# EAGLE board 20150319_QSE_TO_FMC_DP_R5.6_FOR_REVIEW (EAGLE 7.2.0), part 1 of 6
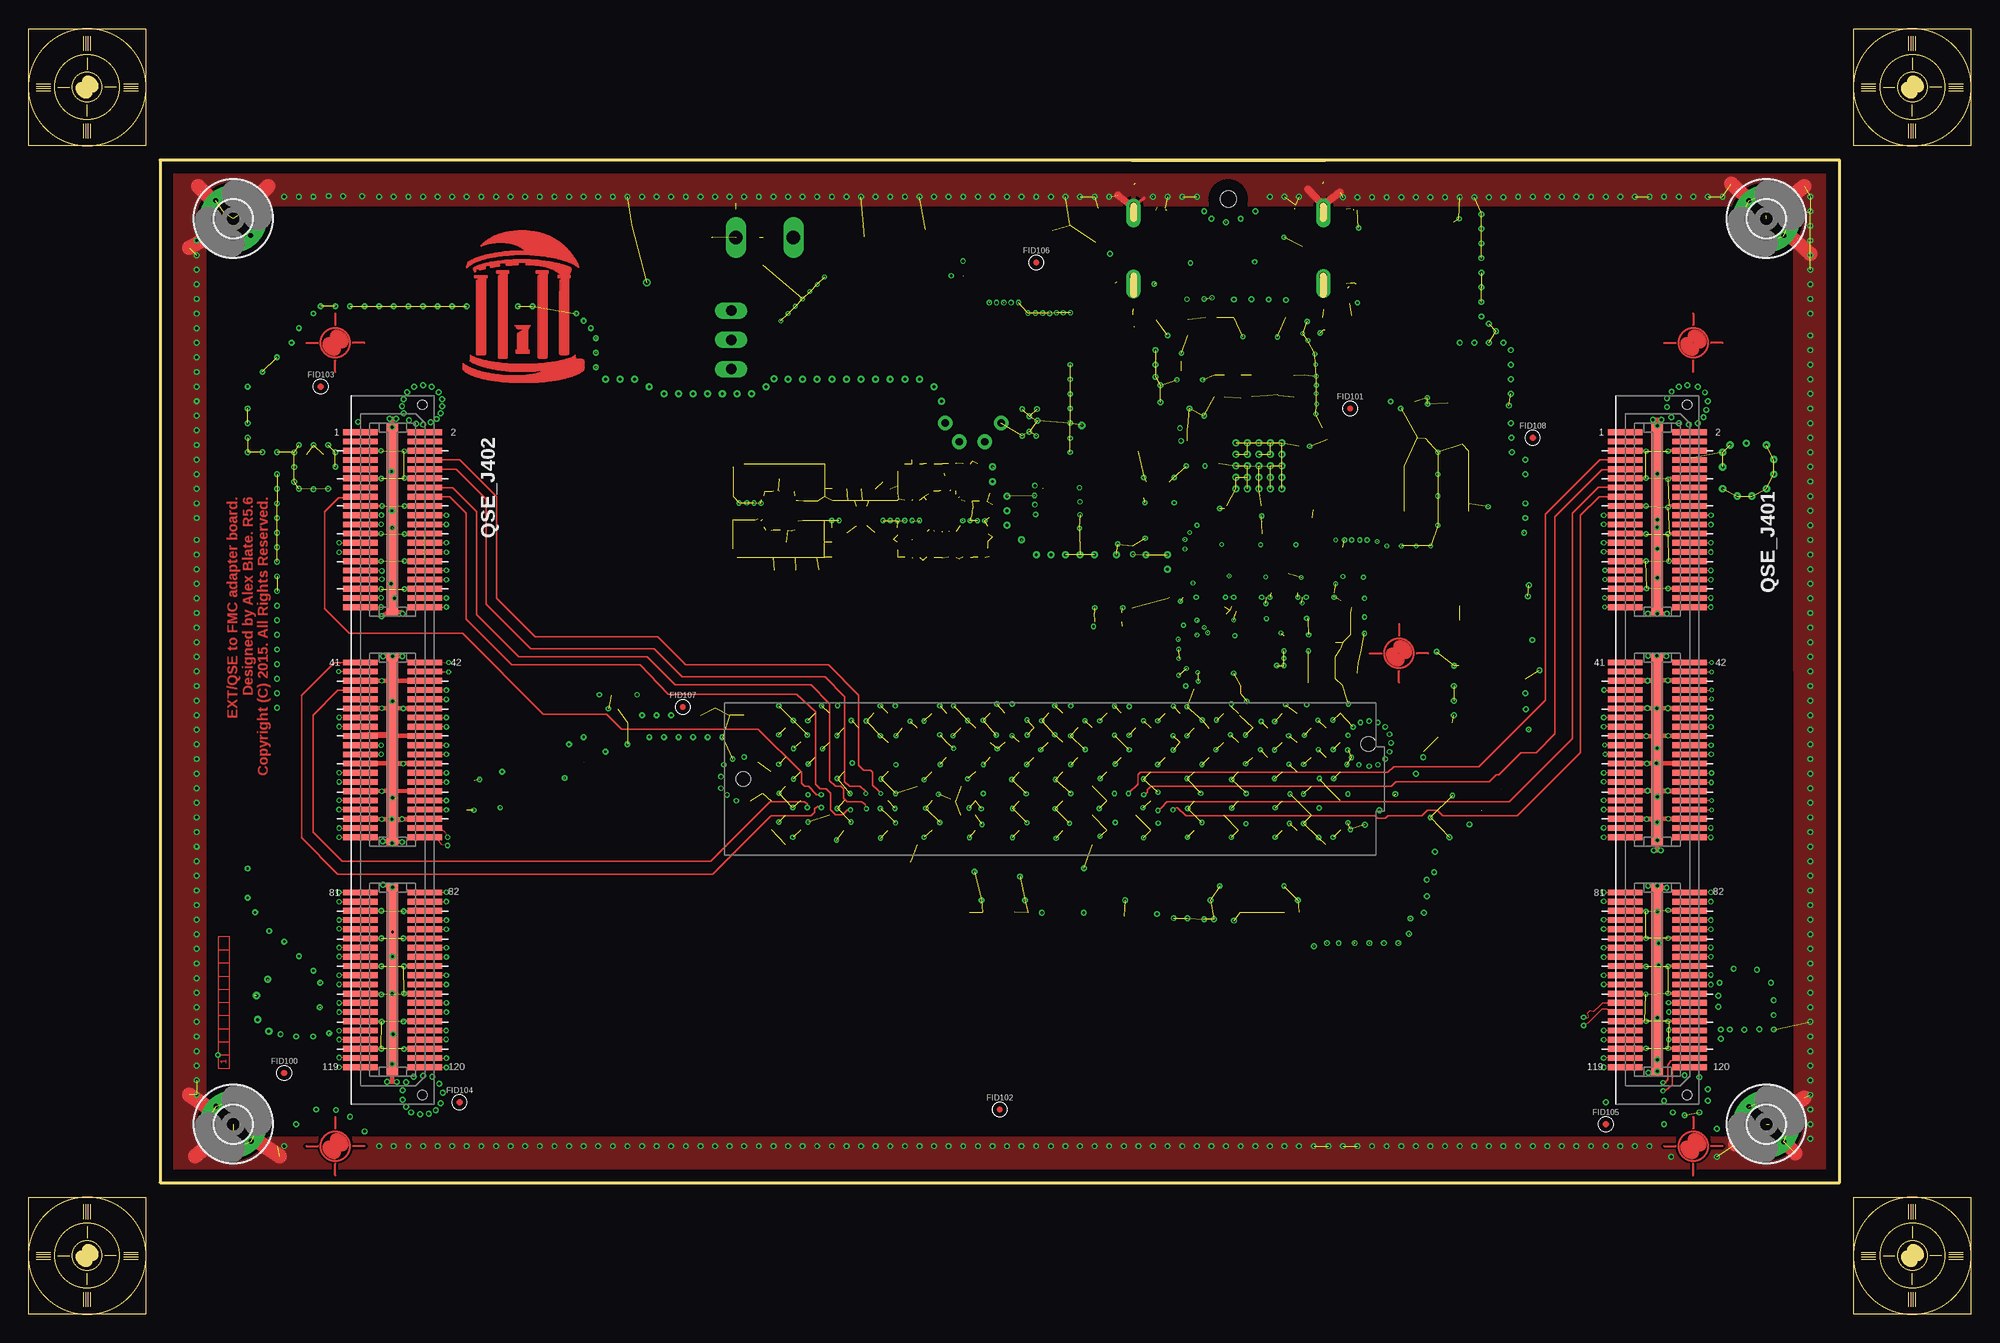
[diagram p8: board, top side]
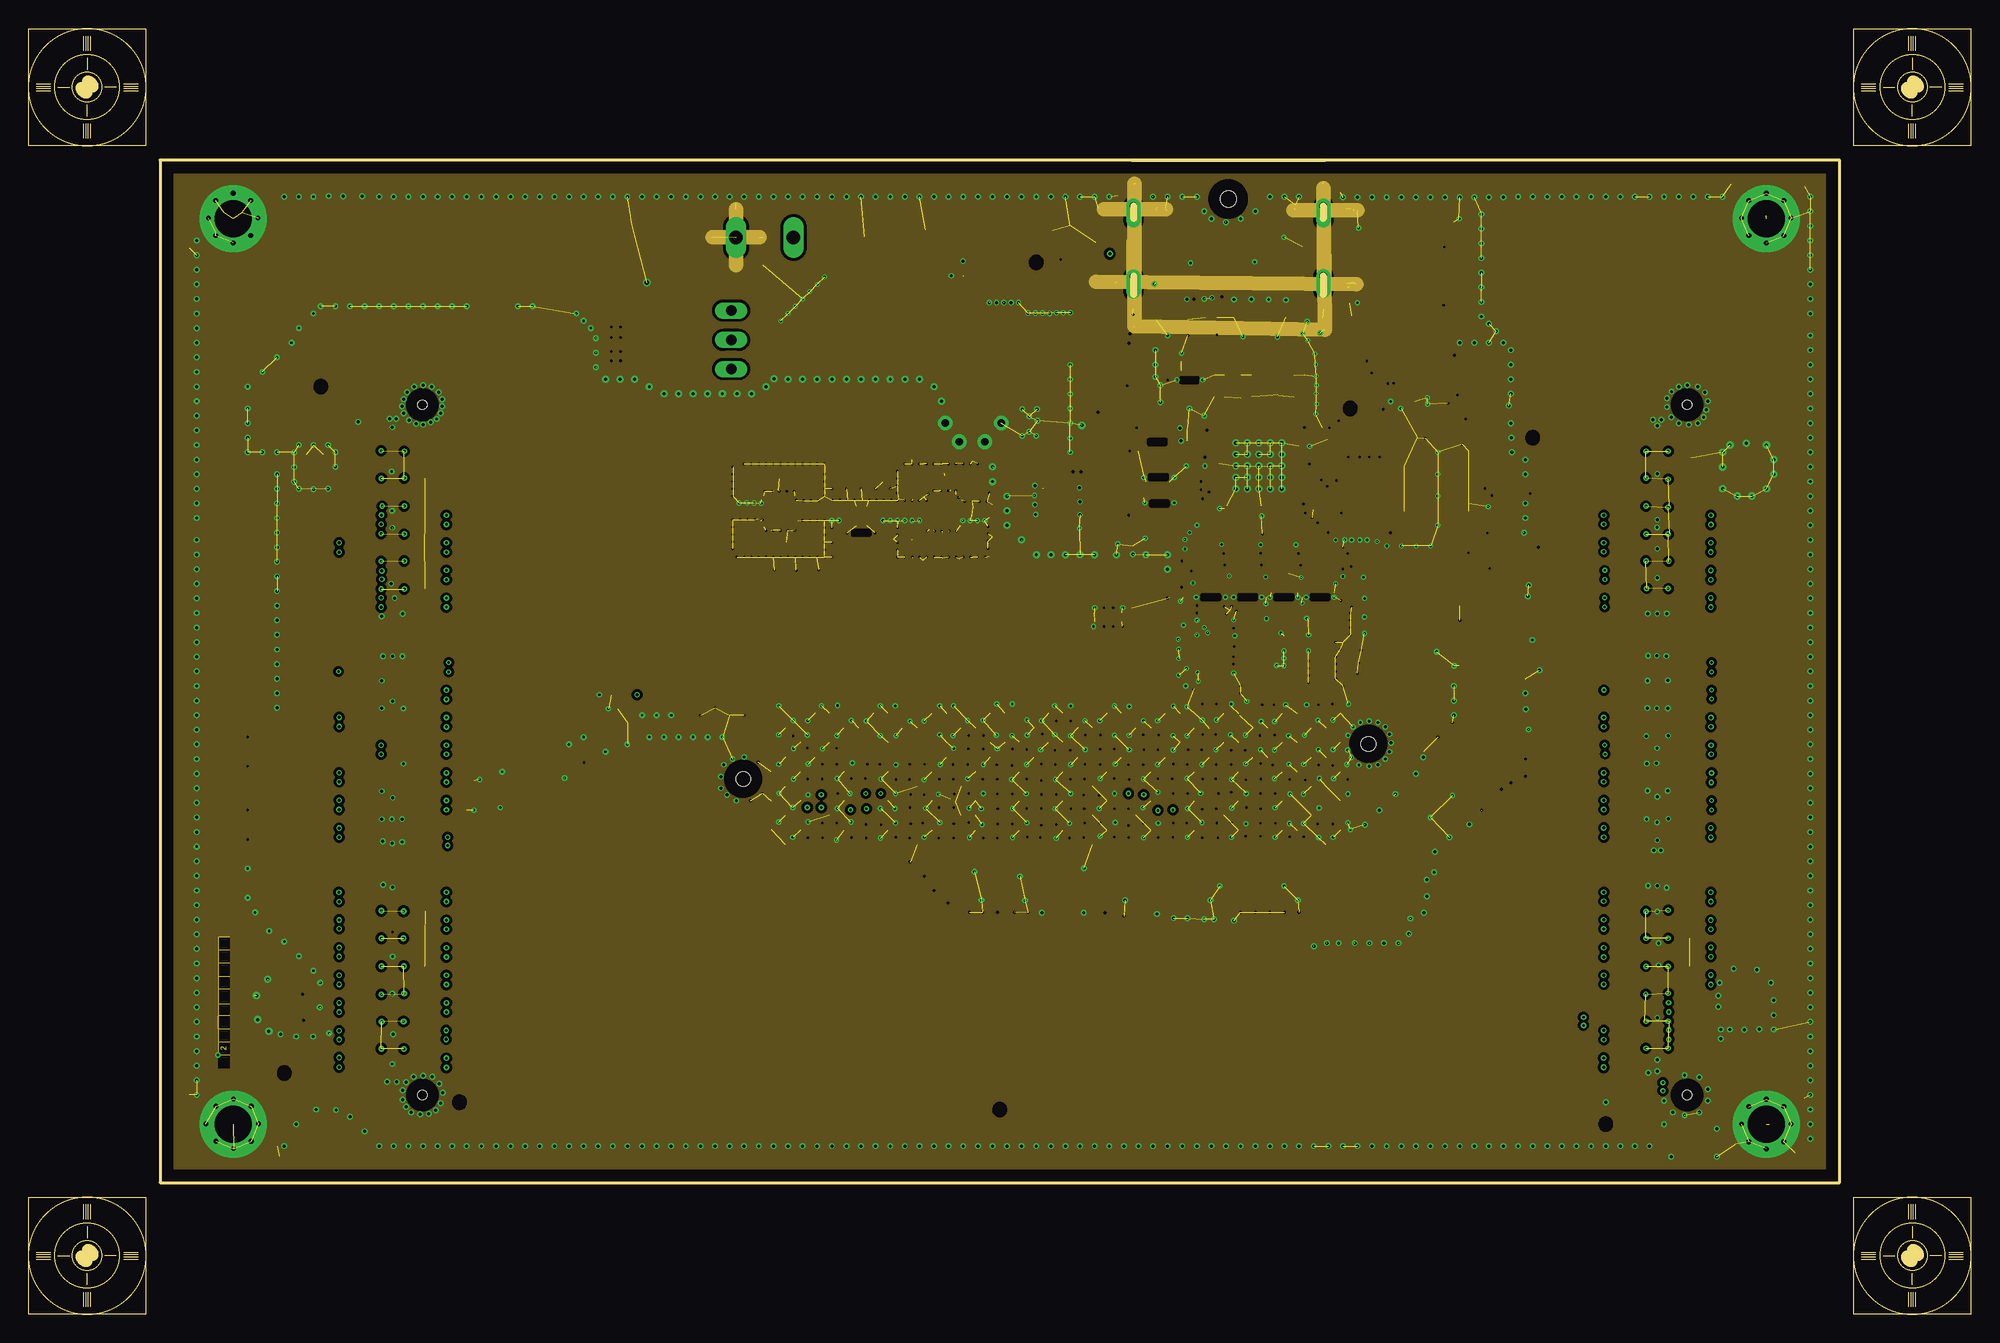
[diagram p9: board, inner layer GND_2]
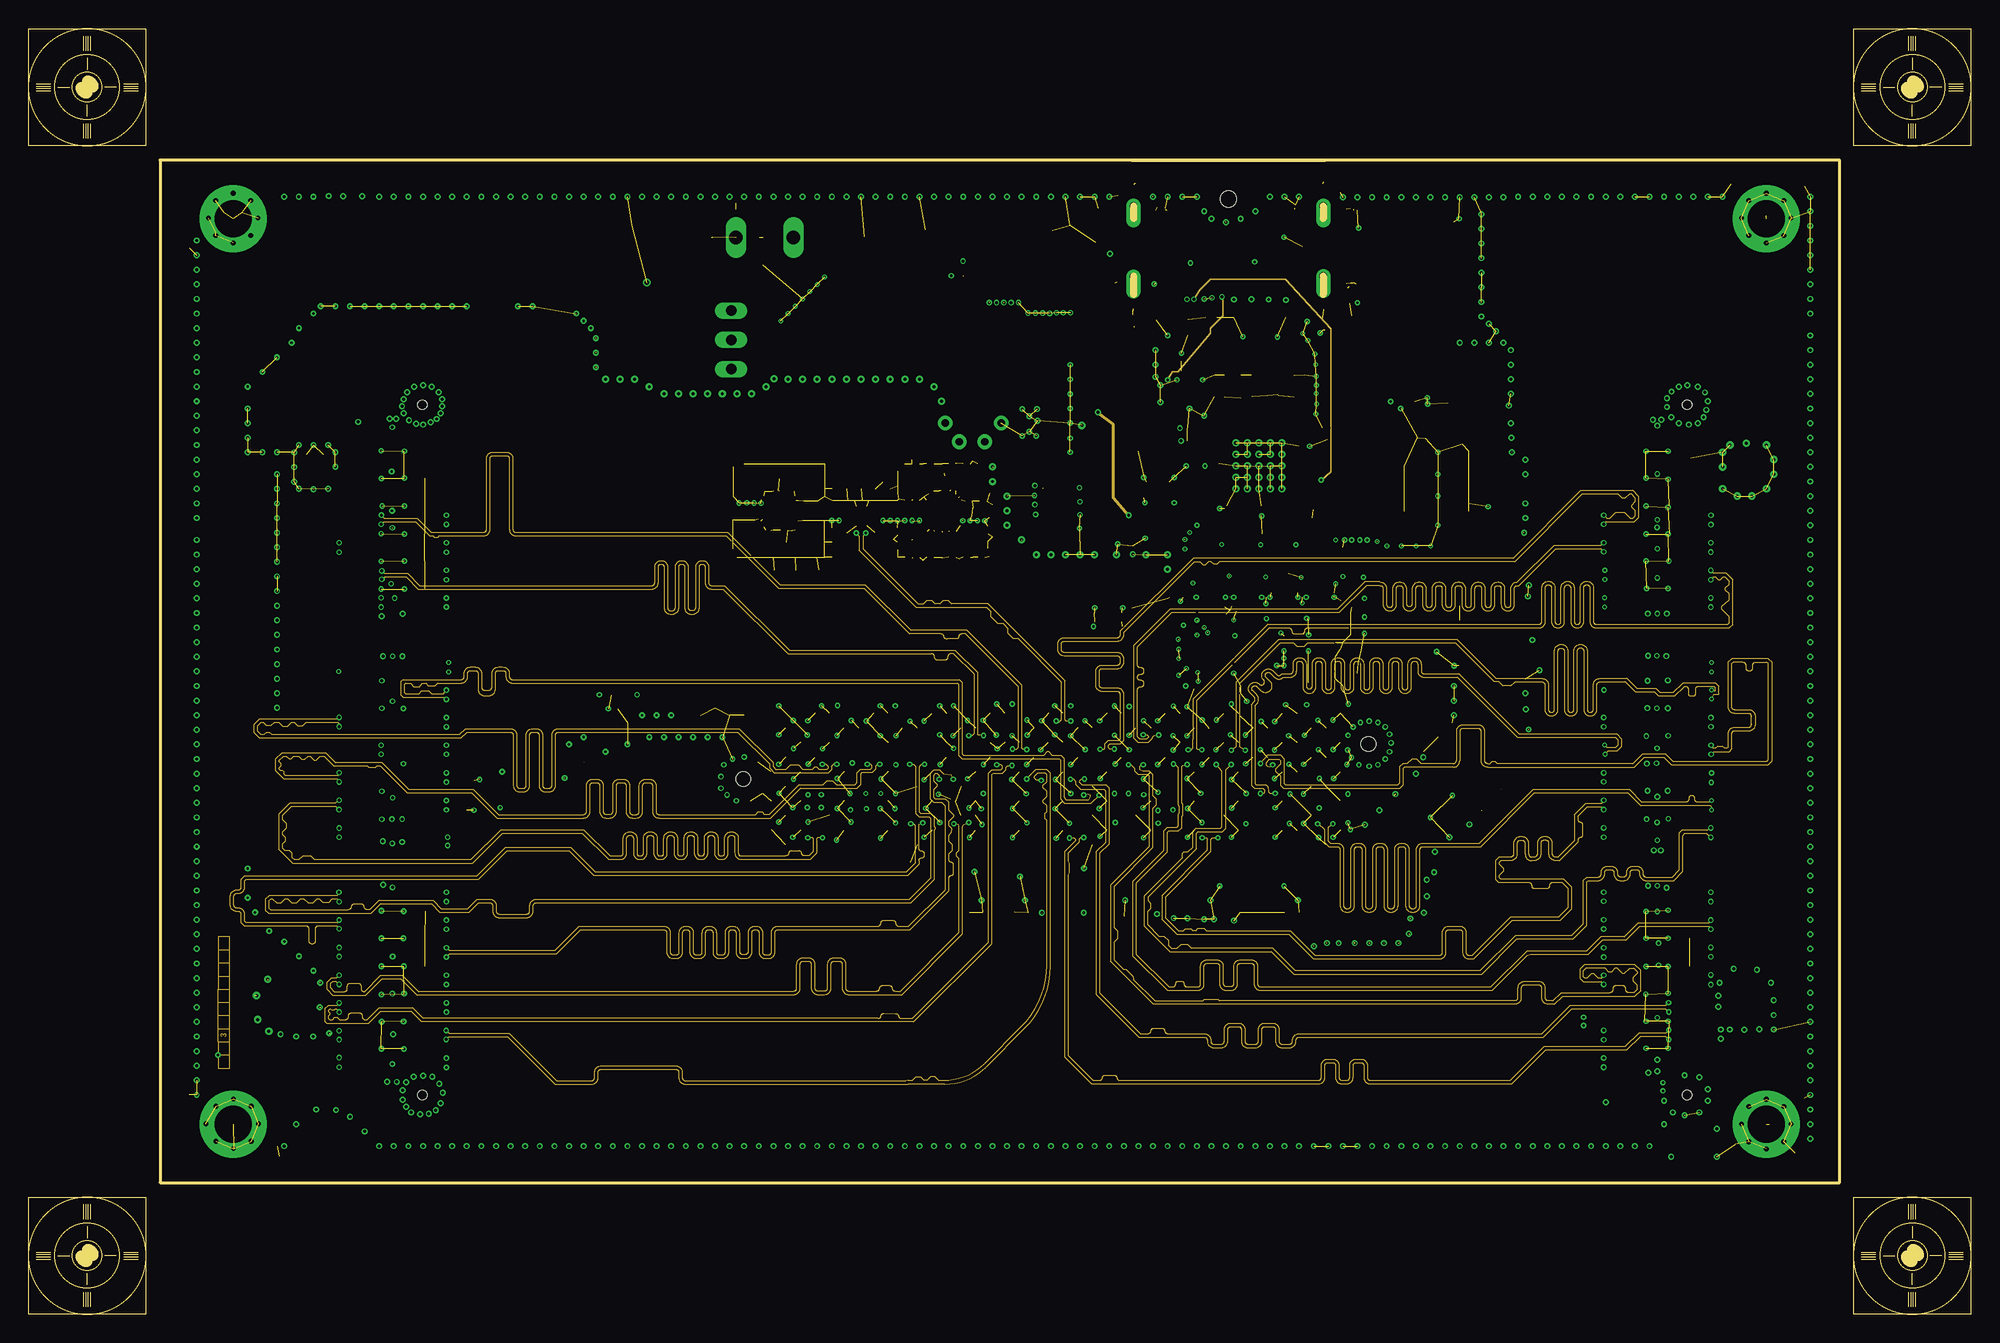
[diagram p10: board, inner layer 3_SIG2]
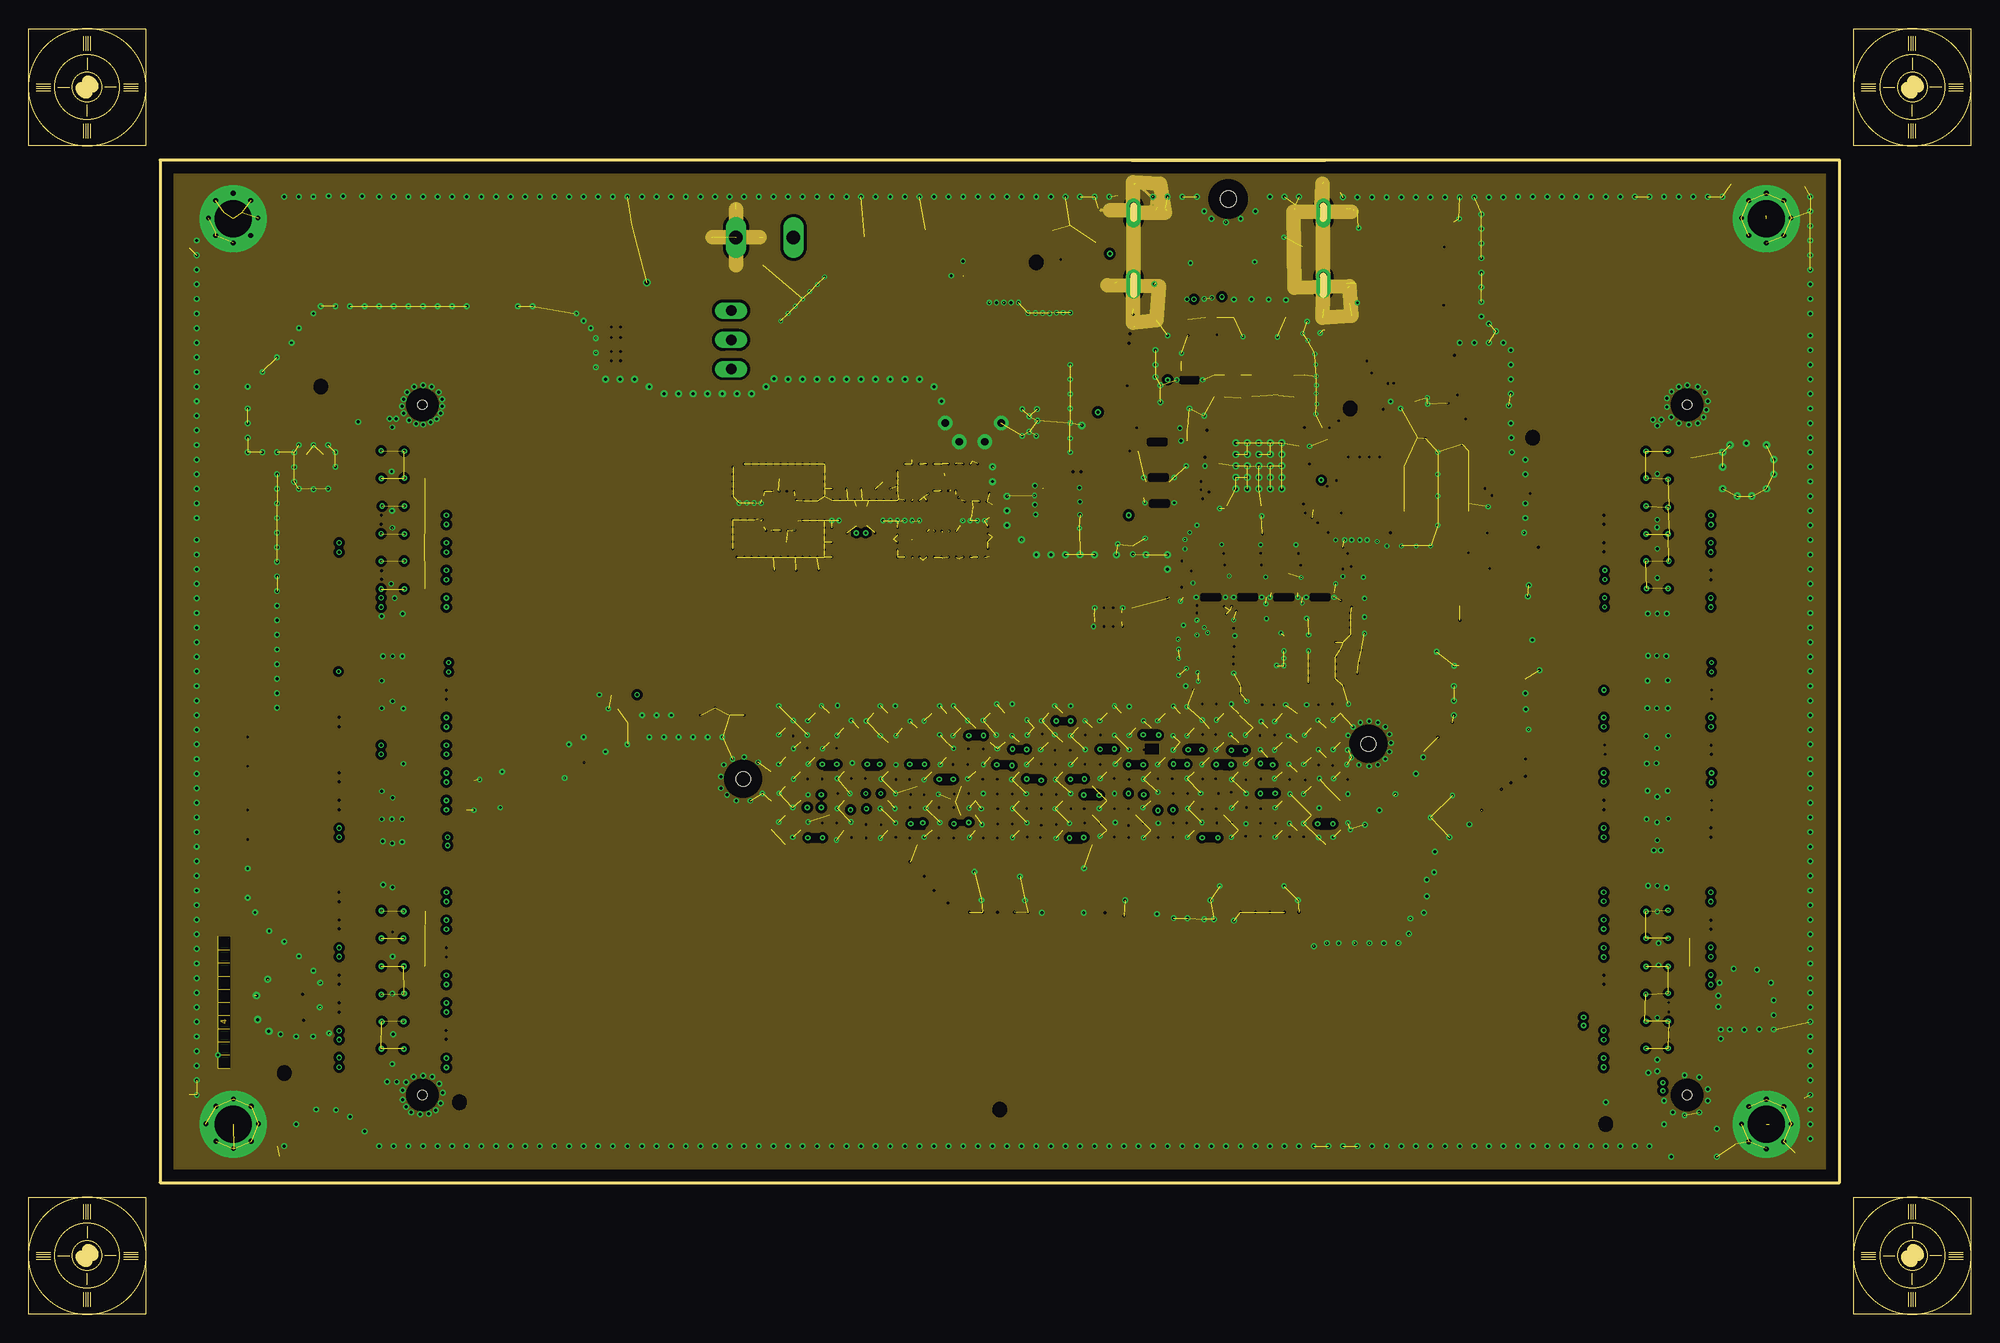
[diagram p11: board, inner layer GND_4]
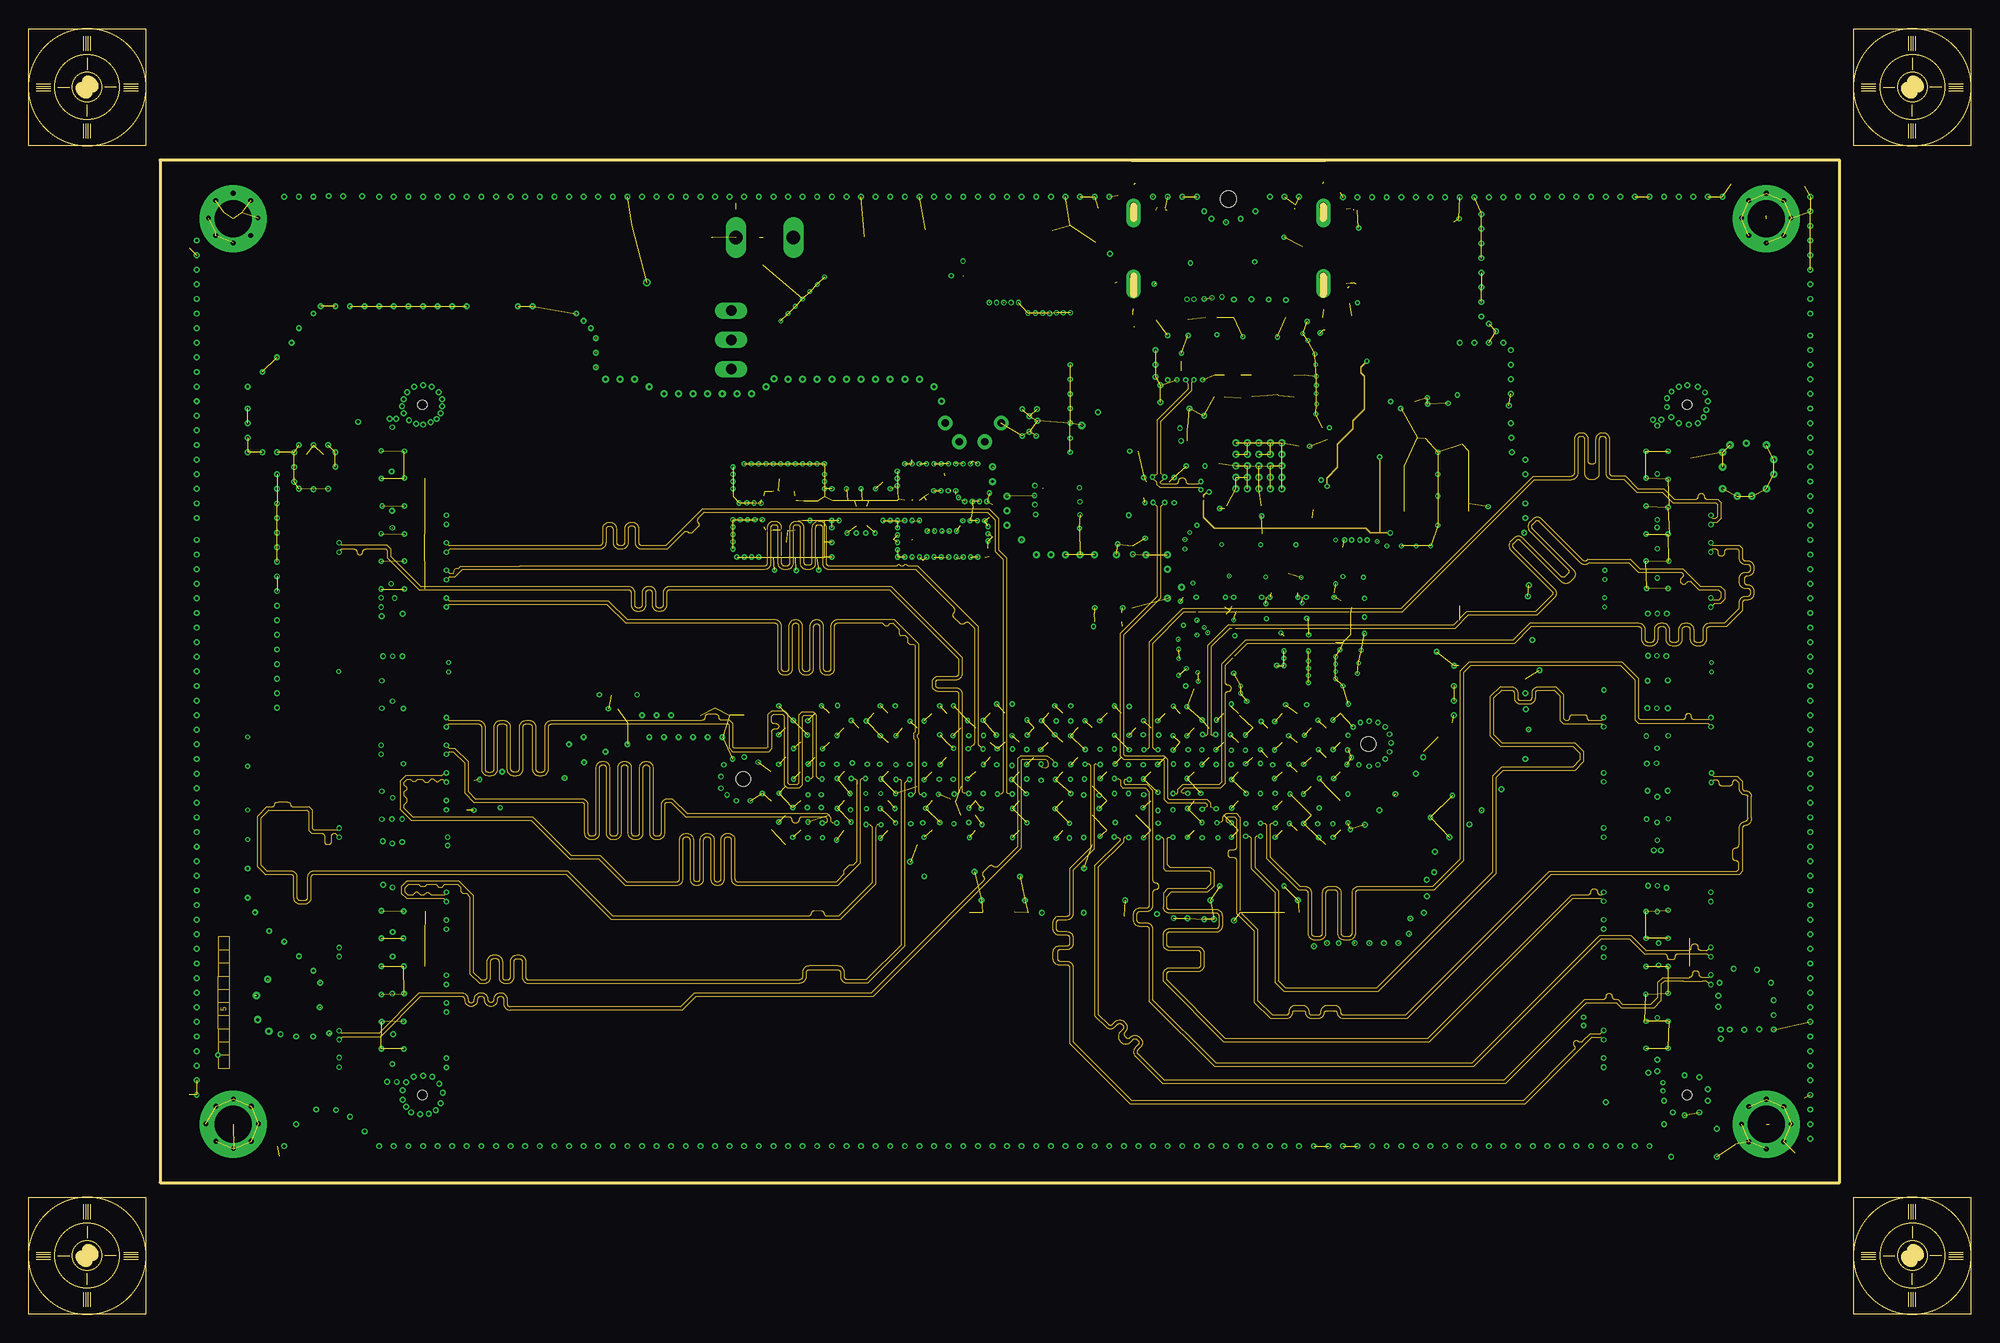
[diagram p12: board, inner layer 5_SIG3]
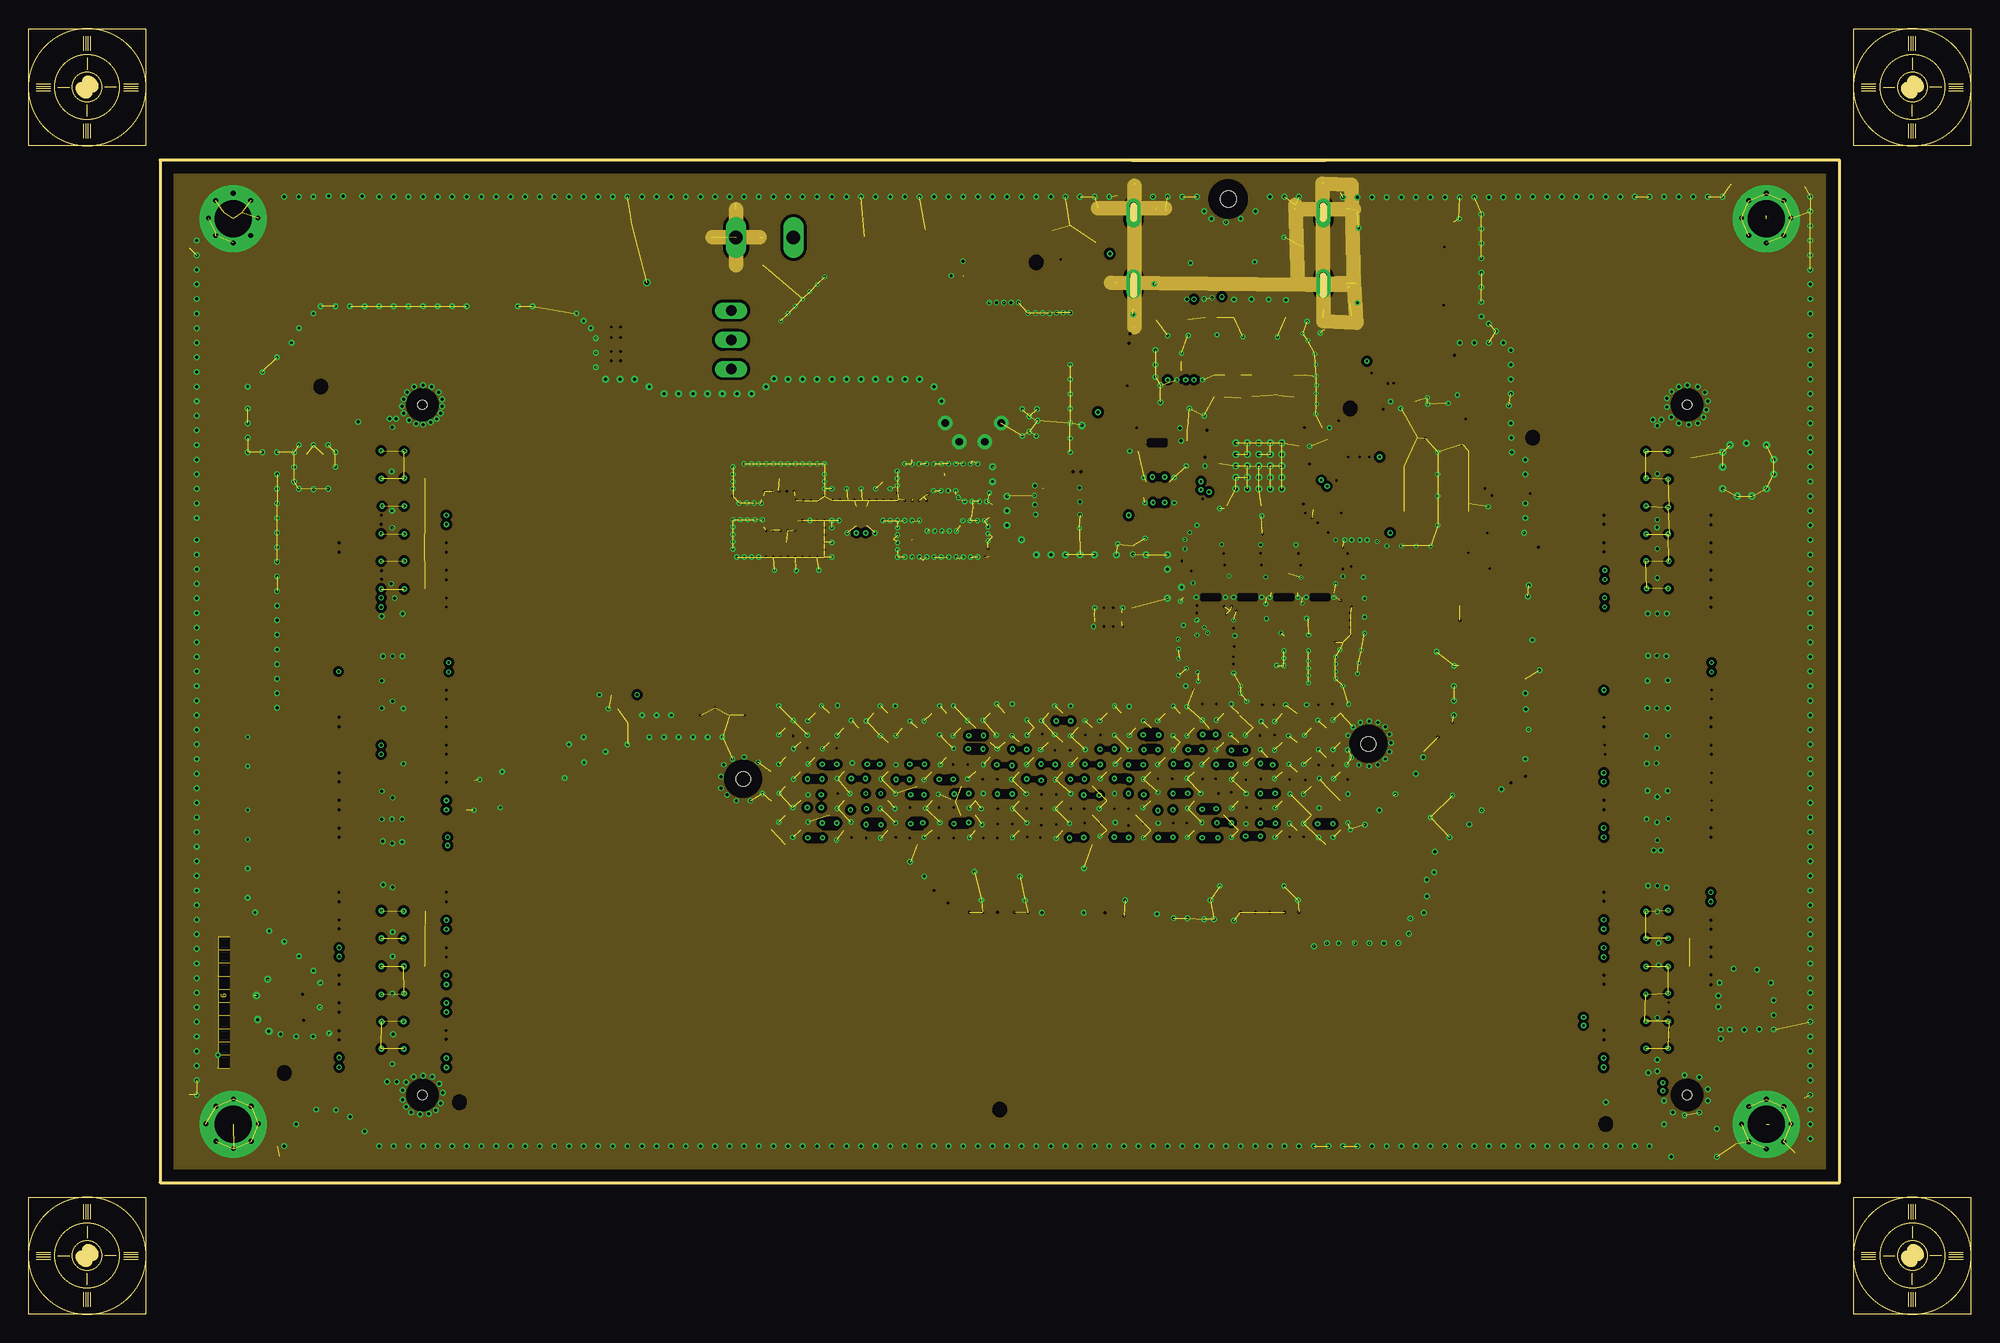
[diagram p13: board, inner layer GND_6]
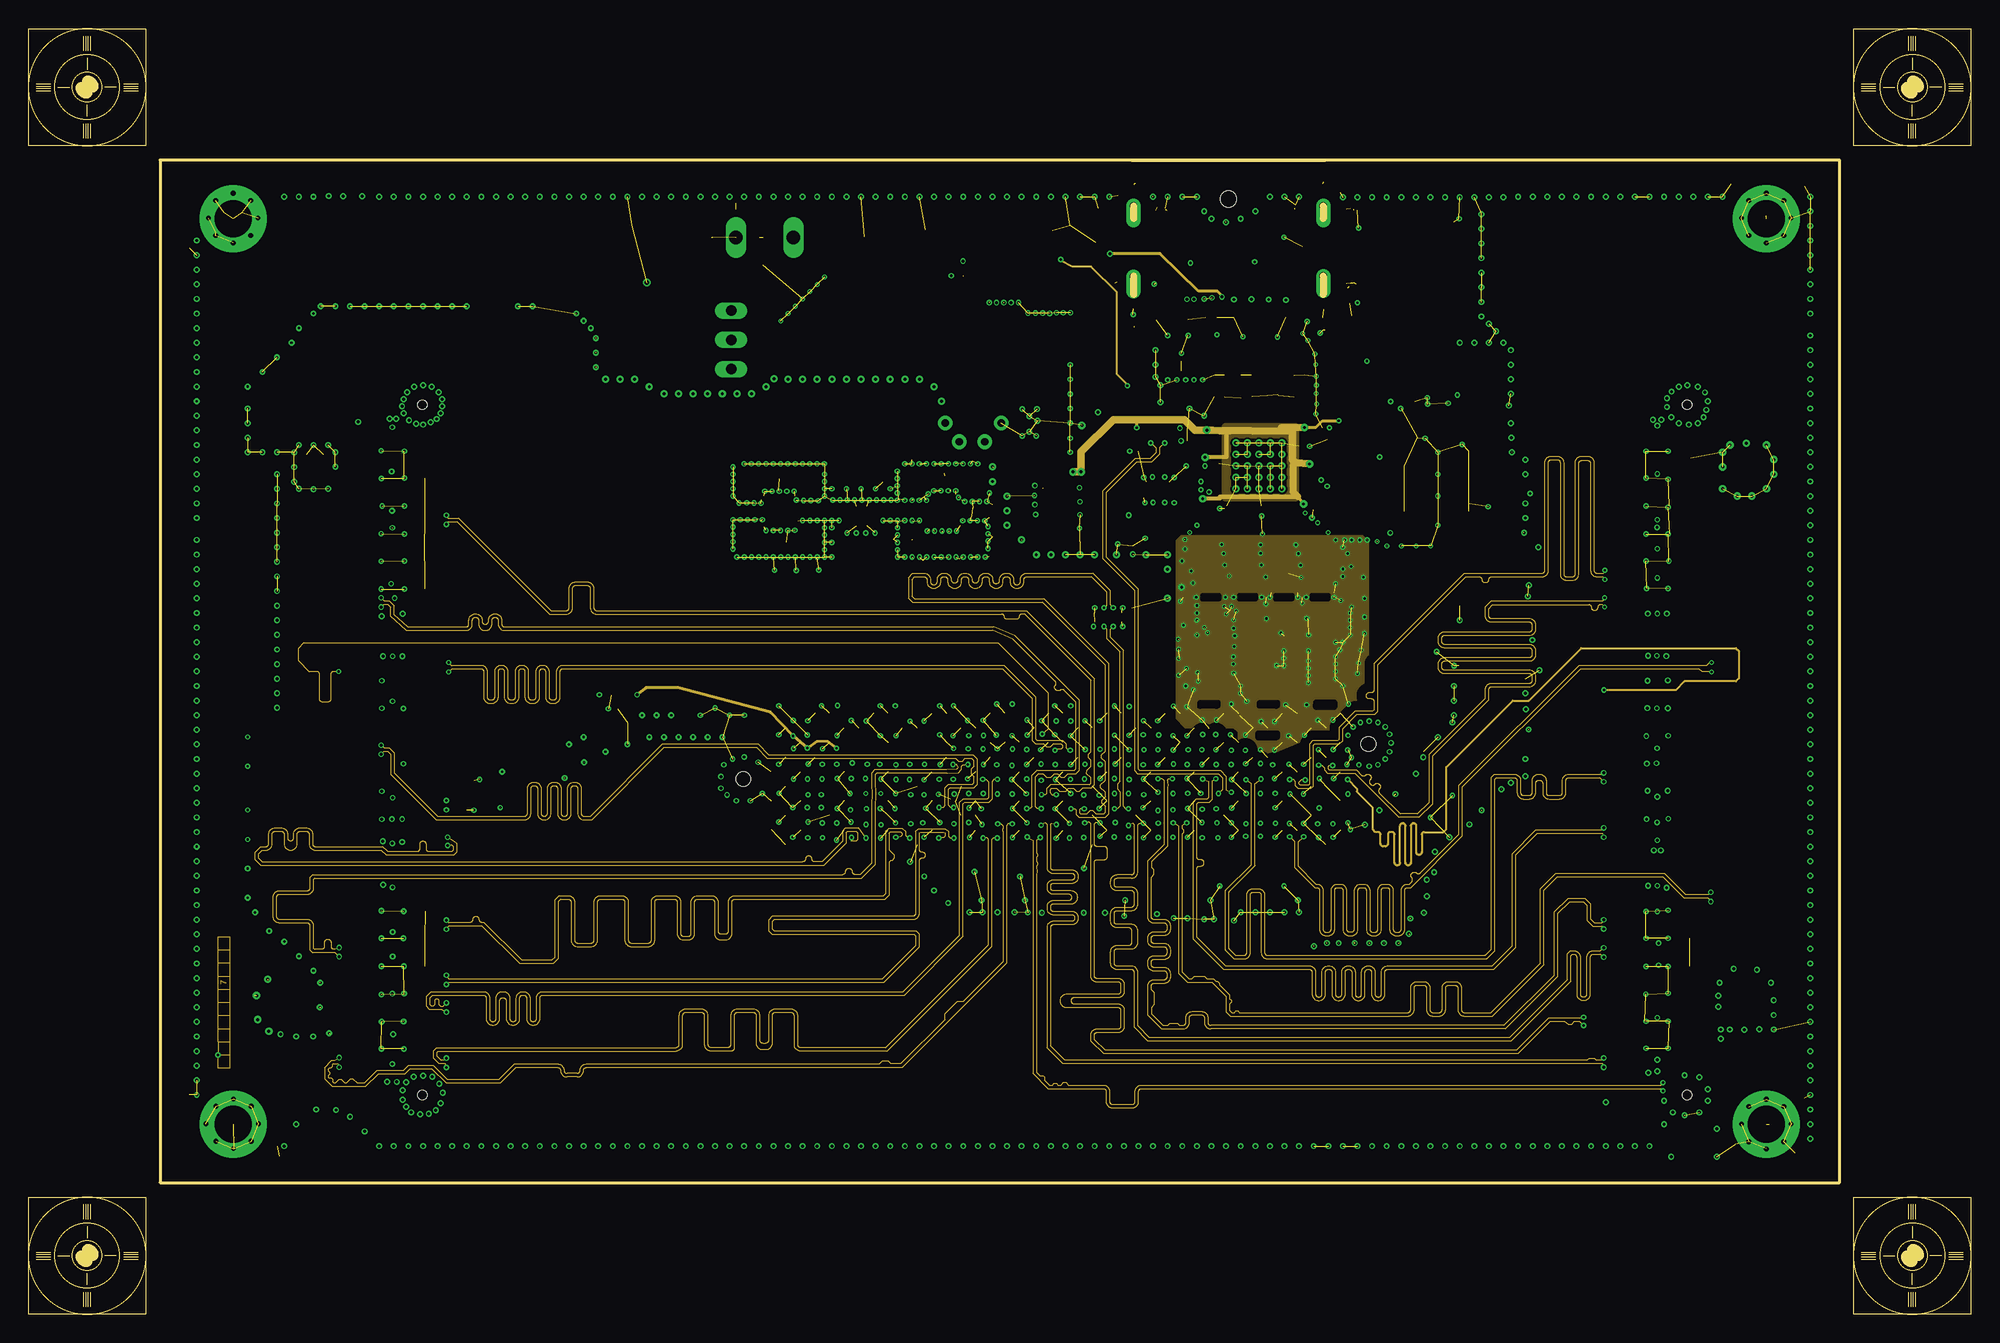
[diagram p14: board, inner layer 7_SIG4]
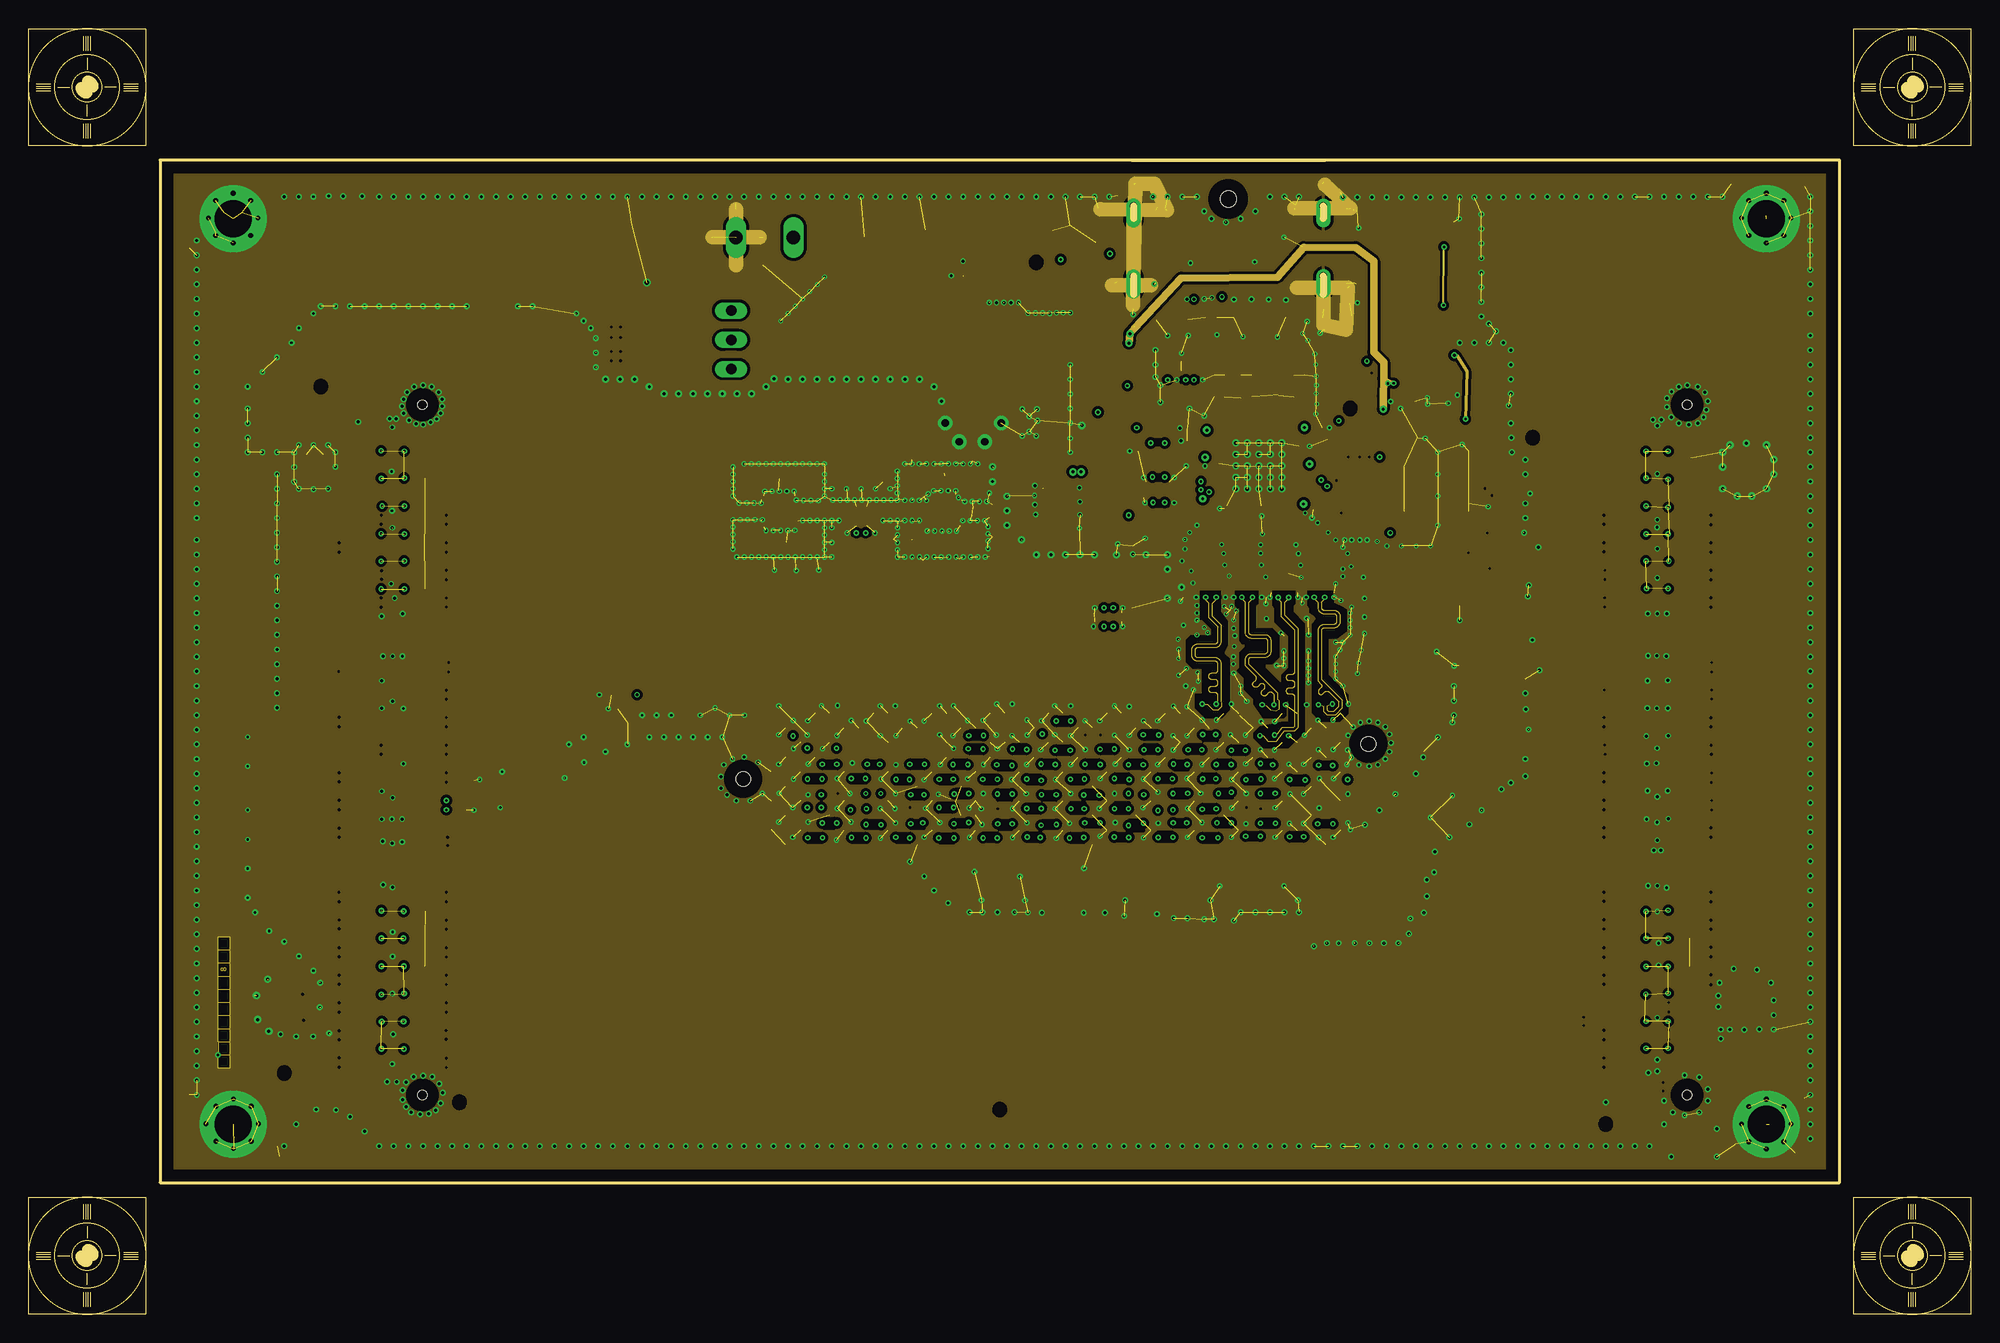
[diagram p15: board, inner layer GND_8]
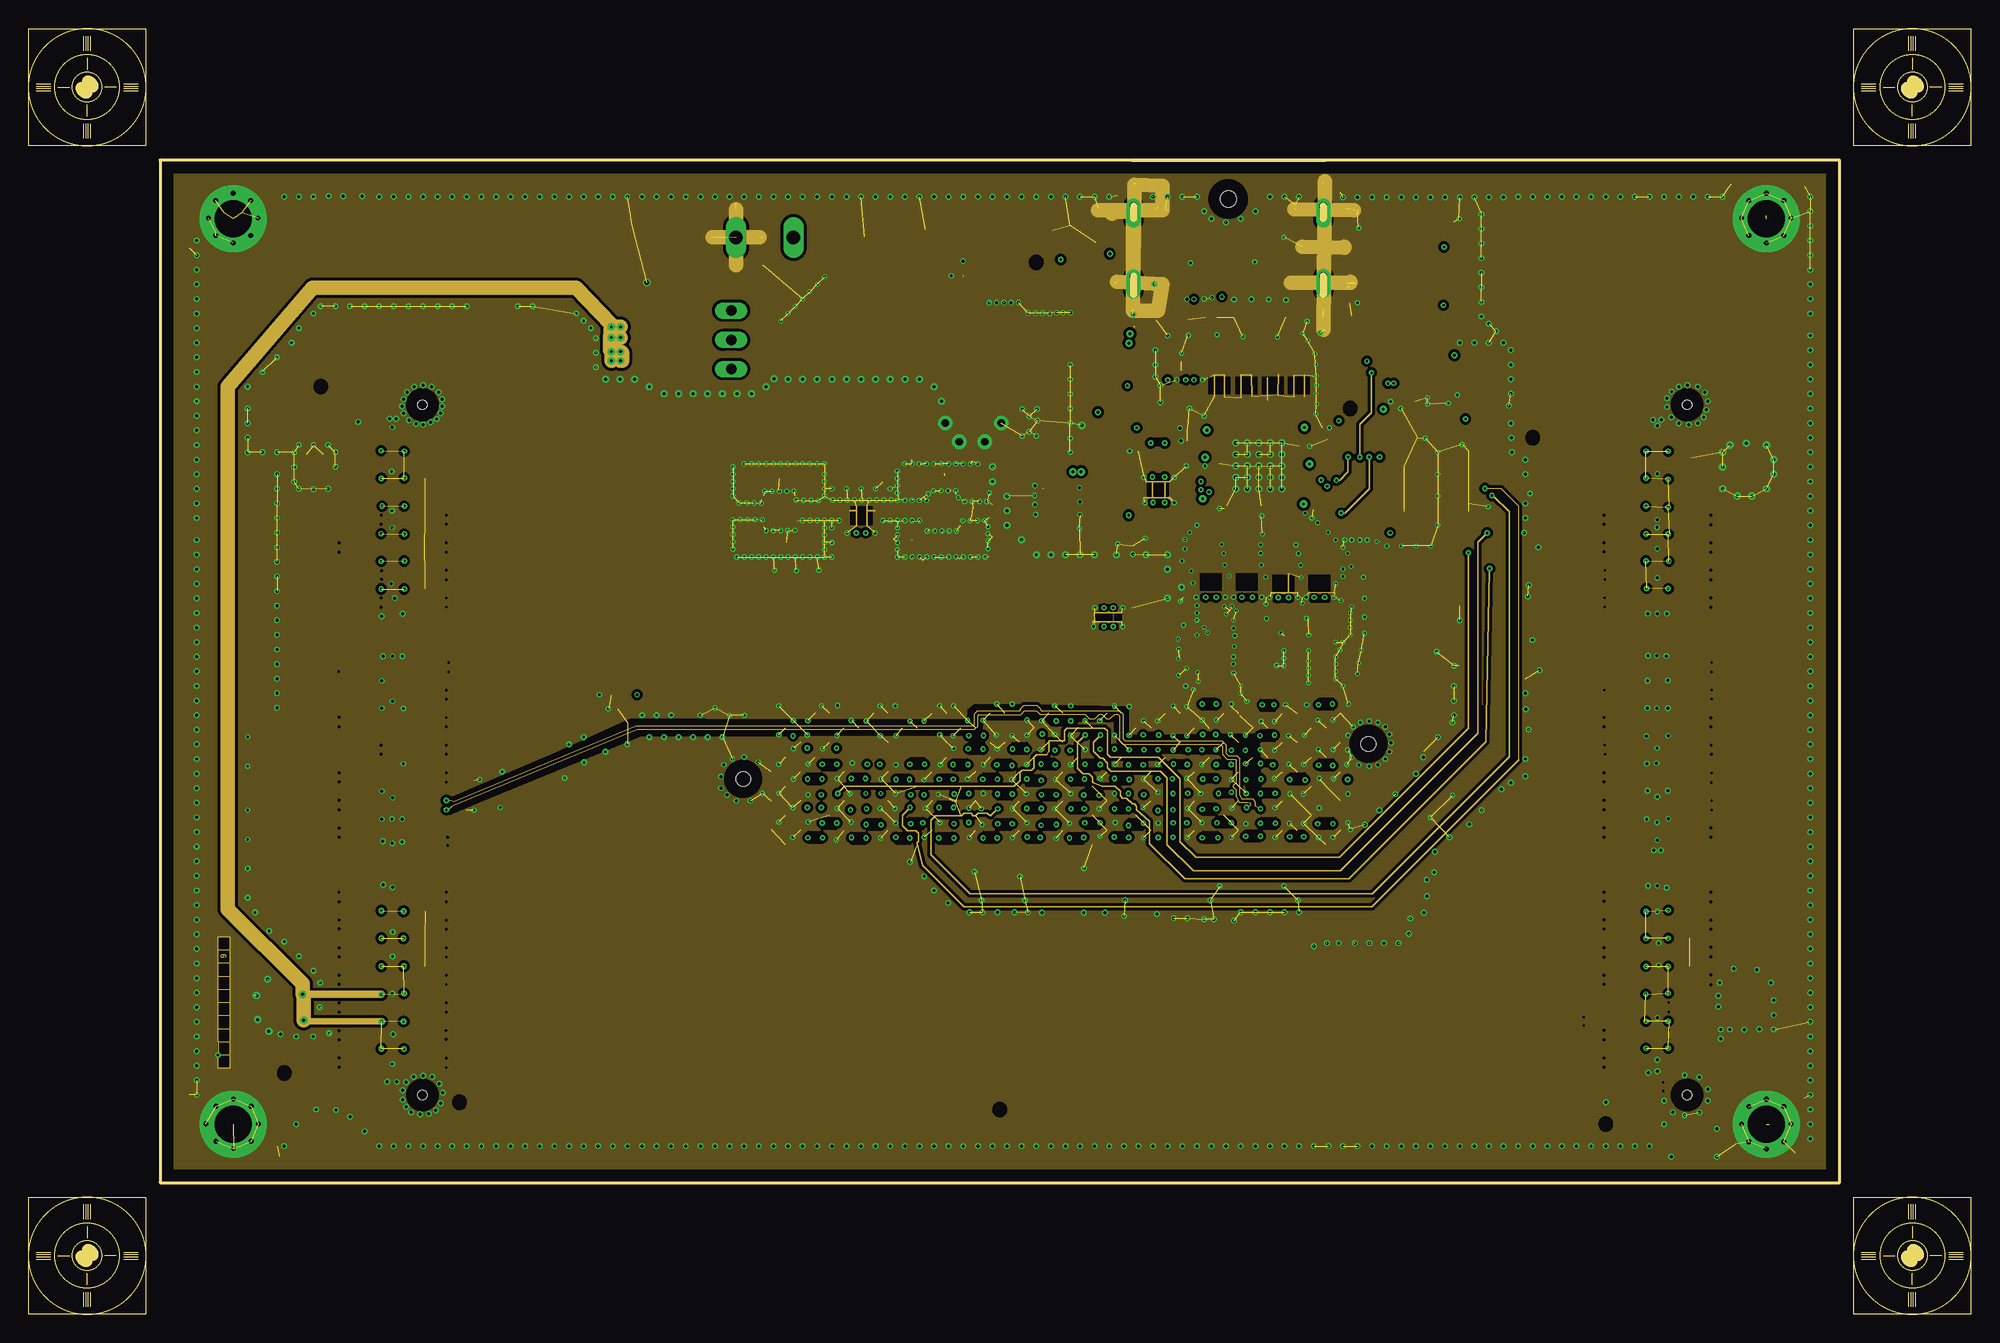
[diagram p16: board, inner layer 9_POWER_GND]
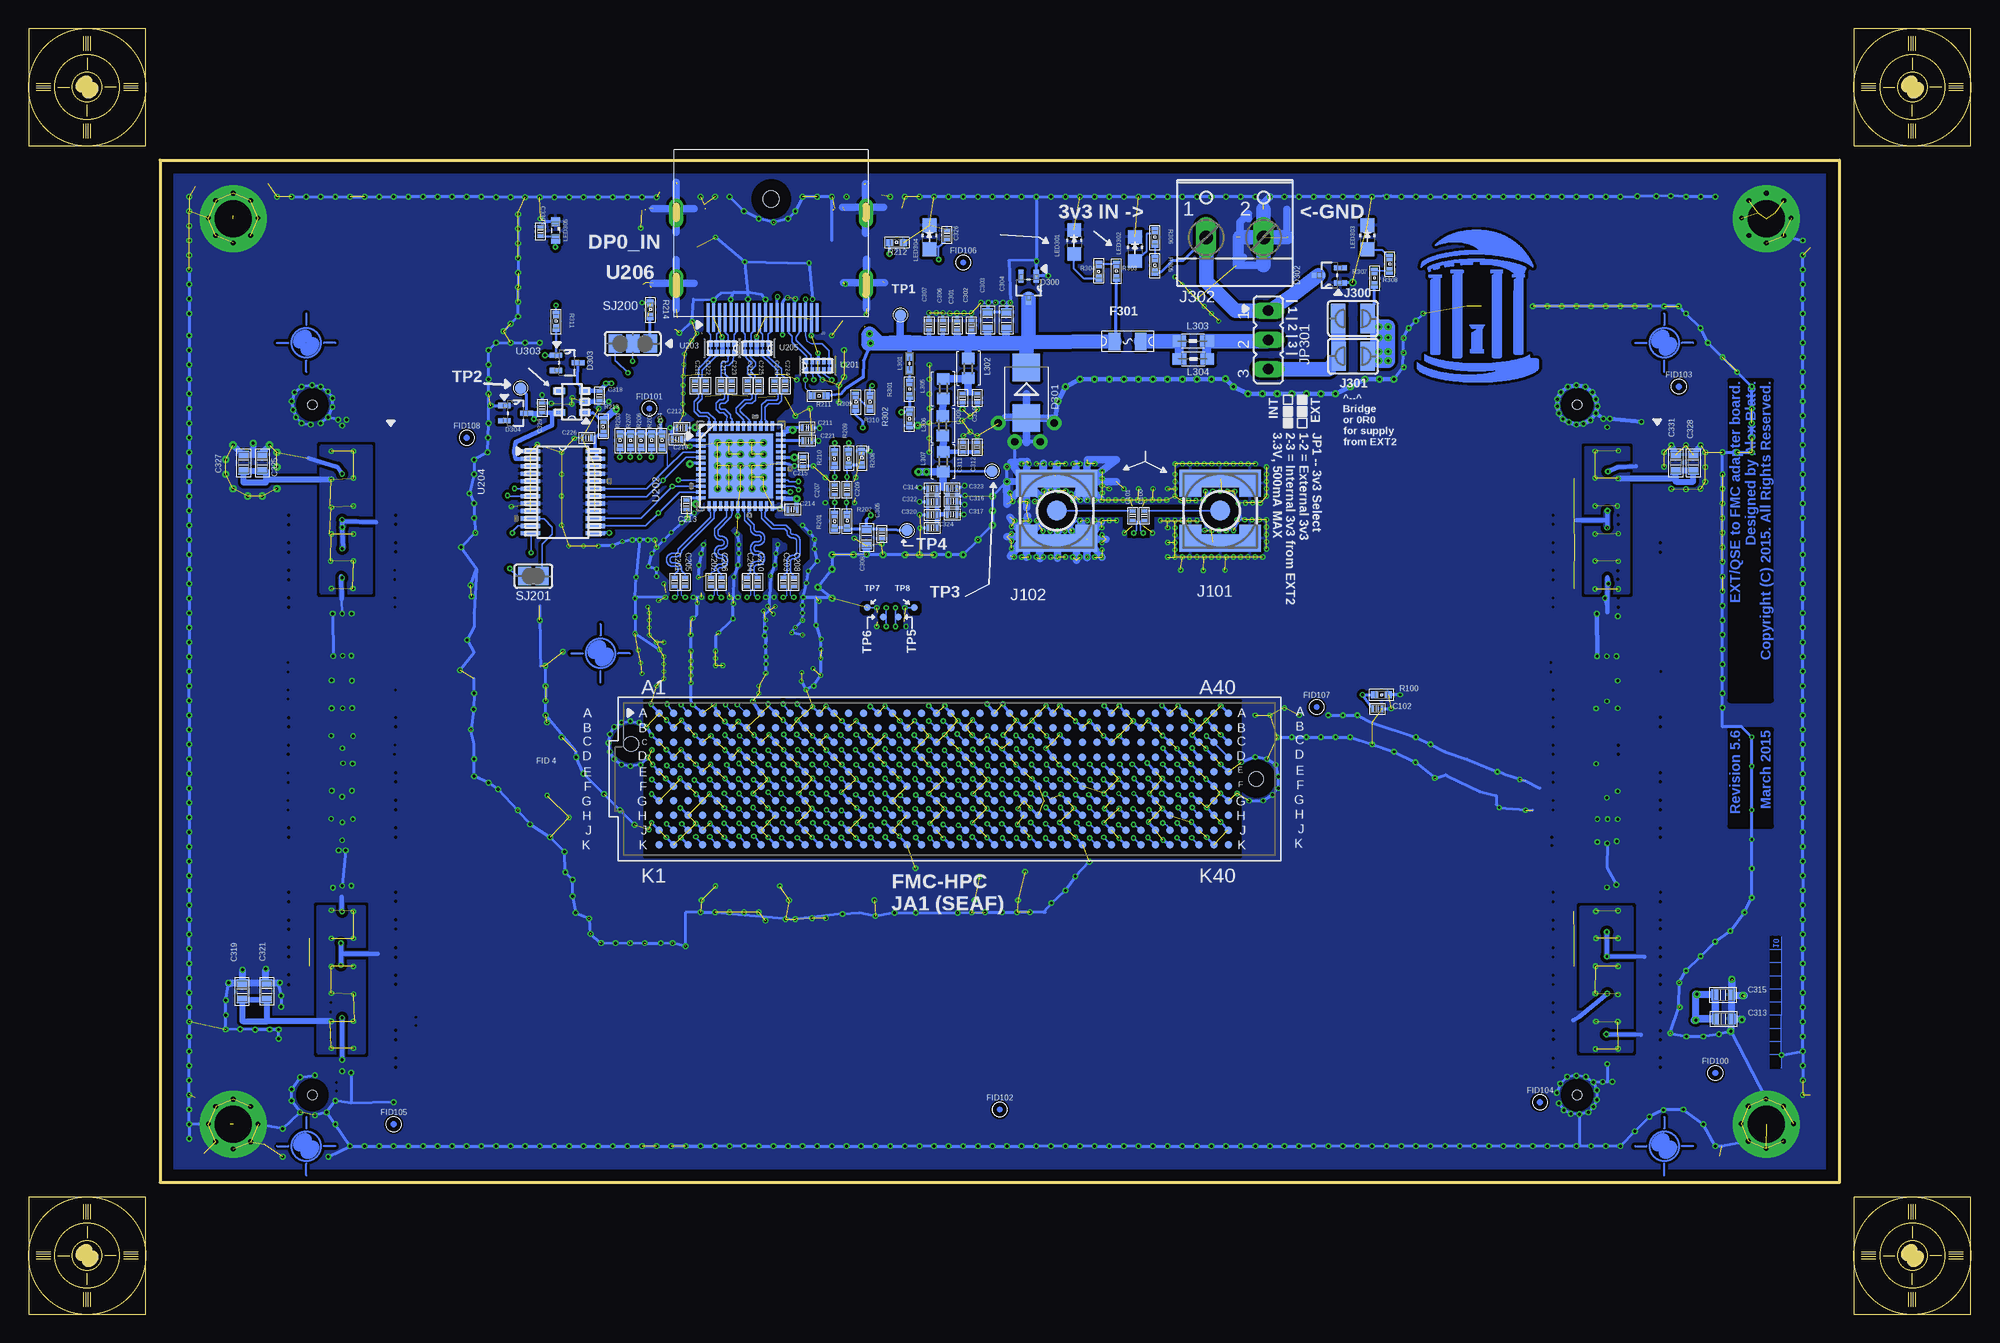
[diagram p17: board, bottom side, seen from below]

Size 146.05 x 88.9 mm. Coordinates in mm from the lower left corner, seen from the top.
Outline: 0,0 146.05,0 146.05,88.9 0,88.9 0,0
Copper layers ([3:[5:[7:[9:1+(2*([9:[7:[5:(3+(4*([9:[7:5+([9:[7:6*(7+([9:8*(9+16):9]))]])]])))]]]))]]]]): Top_SIG1 0.035mm / dielectric 4.5mil / GND_2 0.015240625mm / dielectric 3.5mil / 3_SIG2 0.015240625mm / dielectric 3.5mil / GND_4 0.015240625mm / dielectric 3.5mil / 5_SIG3 0.015240625mm / dielectric 3.5mil / GND_6 0.015240625mm / dielectric 3.5mil / 7_SIG4 0.015240625mm / dielectric 3.5mil / GND_8 0.015240625mm / dielectric 3.5mil / 9_POWER_GND 0.015240625mm / dielectric 4.5mil / Bottom_GND_SIG 0.035mm
Design rules "fmc4 *": minimum track width 1mil, minimum drill 8mil, track to track 6mil, track to pad 6mil, pad to pad 6mil, via to via 6mil, smd to smd 2mil, copper to edge 40mil, drill to drill 8mil, minimum pad ring 10mil, minimum via ring 4mil, stop-mask expansion 2mil, vias tented up to drill 11mil, thermal gap 10mil
Net classes: 0 default: width 0.152 mm; 1 gen_sig: width 0.102 mm, clearance 0.152 mm to class 0, clearance 0.152 mm; 2 diff_sig: width 0.089 mm, drill 0.203 mm, clearance 0.305 mm to class 0, clearance 0.216 mm to class 1, clearance 0.216 mm; 3 GND: width 0.25 mm, drill 0.203 mm, clearance 0.152 mm to class 0, clearance 0.152 mm to class 1, clearance 0.152 mm to class 2; 4 power: width 0.254 mm, clearance 0.152 mm to class 0, clearance 0.152 mm to class 1, clearance 0.152 mm to class 2, clearance 0.152 mm to class 3, clearance 0.152 mm; 5 diff_top: width 0.127 mm, drill 0.203 mm, clearance 0.305 mm to class 0, clearance 0.152 mm to class 1, clearance 0.152 mm to class 2, clearance 0.152 mm to class 3, clearance 0.152 mm to class 4, clearance 0.254 mm; 6 diff_buried: width 0.102 mm, drill 0.203 mm, clearance 0.305 mm to class 0, clearance 0.305 mm to class 1, clearance 0.203 mm to class 2, clearance 0.305 mm to class 3, clearance 0.203 mm to class 4, clearance 0.203 mm to class 5, clearance 0.203 mm; 8 DP: width 0.127 mm, drill 0.203 mm, clearance 0.178 mm
tKeepout: area 125.1,4.4 to 126.4,5.7

## Footprints (pad centres in the part's own frame; a part is rotated, then mirrored left to right if it is on the bottom)
CAPC1005X60N = smd 0.305 x 0.61: 1 -0.406,0; 2 0.406,0
CAPC1608X85N = smd 0.66 x 0.94: 1 -0.711,0; 2 0.711,0
SOT65P210X100-3N = smd 1.118 x 0.457: 1 -0.965,0.66; 2 -0.965,-0.66; 3 0.965,0
SMB = smd 2.4 x 2.4: A 2.2,0; C -2.2,0
SMD-0805 = smd 1.016 x 1.524: 1 -1.143,0; 2 1.143,0
3,2-PAD = drill 3.2 pad 5.842: B3,2 0,0
SEAF-40-10 = smd 0.635 x 0.635: A1 0,0; A2 -1.27,0; A3 -2.54,0; A4 -3.81,0; A5 -5.08,0; A6 -6.35,0; A7 -7.62,0; A8 -8.89,0; A9 -10.16,0; A10 -11.43,0; A11 -12.7,0; A12 -13.97,0; A13 -15.24,0; A14 -16.51,0; A15 -17.78,0; A16 -19.05,0; A17 -20.32,0; A18 -21.59,0; A19 -22.86,0; A20 -24.13,0; A21 -25.4,0; A22 -26.67,0; A23 -27.94,0; A24 -29.21,0; A25 -30.48,0; A26 -31.75,0; A27 -33.02,0; A28 -34.29,0; A29 -35.56,0; A30 -36.83,0; A31 -38.1,0; A32 -39.37,0; A33 -40.64,0; A34 -41.91,0; A35 -43.18,0; A36 -44.45,0; A37 -45.72,0; A38 -46.99,0; A39 -48.26,0; A40 -49.53,0; B1 0,1.27; B2 -1.27,1.27; B3 -2.54,1.27; B4 -3.81,1.27; B5 -5.08,1.27; B6 -6.35,1.27; B7 -7.62,1.27; B8 -8.89,1.27; B9 -10.16,1.27; B10 -11.43,1.27; B11 -12.7,1.27; B12 -13.97,1.27; B13 -15.24,1.27; B14 -16.51,1.27; B15 -17.78,1.27; B16 -19.05,1.27; B17 -20.32,1.27; B18 -21.59,1.27; B19 -22.86,1.27; B20 -24.13,1.27; B21 -25.4,1.27; B22 -26.67,1.27; B23 -27.94,1.27; B24 -29.21,1.27; B25 -30.48,1.27; B26 -31.75,1.27; B27 -33.02,1.27; B28 -34.29,1.27; B29 -35.56,1.27; B30 -36.83,1.27; B31 -38.1,1.27; B32 -39.37,1.27; B33 -40.64,1.27; B34 -41.91,1.27; B35 -43.18,1.27; B36 -44.45,1.27; B37 -45.72,1.27; B38 -46.99,1.27; B39 -48.26,1.27; B40 -49.53,1.27; C1 0,2.54; C2 -1.27,2.54; C3 -2.54,2.54; C4 -3.81,2.54; C5 -5.08,2.54; C6 -6.35,2.54; C7 -7.62,2.54; C8 -8.89,2.54; C9 -10.16,2.54; C10 -11.43,2.54; C11 -12.7,2.54; C12 -13.97,2.54; C13 -15.24,2.54; C14 -16.51,2.54; C15 -17.78,2.54; C16 -19.05,2.54; C17 -20.32,2.54; C18 -21.59,2.54; C19 -22.86,2.54; C20 -24.13,2.54; C21 -25.4,2.54; C22 -26.67,2.54; C23 -27.94,2.54; C24 -29.21,2.54; C25 -30.48,2.54; C26 -31.75,2.54; C27 -33.02,2.54; C28 -34.29,2.54; C29 -35.56,2.54; C30 -36.83,2.54; C31 -38.1,2.54; C32 -39.37,2.54; C33 -40.64,2.54; C34 -41.91,2.54; C35 -43.18,2.54; C36 -44.45,2.54; C37 -45.72,2.54; C38 -46.99,2.54; C39 -48.26,2.54; C40 -49.53,2.54; D1 0,3.81; D2 -1.27,3.81; D3 -2.54,3.81; D4 -3.81,3.81; D5 -5.08,3.81; D6 -6.35,3.81; D7 -7.62,3.81; D8 -8.89,3.81; D9 -10.16,3.81; D10 -11.43,3.81; D11 -12.7,3.81; D12 -13.97,3.81; D13 -15.24,3.81; D14 -16.51,3.81; D15 -17.78,3.81; D16 -19.05,3.81; D17 -20.32,3.81; D18 -21.59,3.81; D19 -22.86,3.81; D20 -24.13,3.81; D21 -25.4,3.81; D22 -26.67,3.81; D23 -27.94,3.81; D24 -29.21,3.81; D25 -30.48,3.81; D26 -31.75,3.81; D27 -33.02,3.81; D28 -34.29,3.81; D29 -35.56,3.81; D30 -36.83,3.81; D31 -38.1,3.81; D32 -39.37,3.81; D33 -40.64,3.81; D34 -41.91,3.81; D35 -43.18,3.81; D36 -44.45,3.81; D37 -45.72,3.81; D38 -46.99,3.81; D39 -48.26,3.81; D40 -49.53,3.81; E1 0,5.08; E2 -1.27,5.08; E3 -2.54,5.08; E4 -3.81,5.08; E5 -5.08,5.08; E6 -6.35,5.08; E7 -7.62,5.08; E8 -8.89,5.08; E9 -10.16,5.08; E10 -11.43,5.08; E11 -12.7,5.08; E12 -13.97,5.08; E13 -15.24,5.08; E14 -16.51,5.08; E15 -17.78,5.08; E16 -19.05,5.08; E17 -20.32,5.08; E18 -21.59,5.08; E19 -22.86,5.08; E20 -24.13,5.08; E21 -25.4,5.08; E22 -26.67,5.08; E23 -27.94,5.08; E24 -29.21,5.08; E25 -30.48,5.08; E26 -31.75,5.08; E27 -33.02,5.08; E28 -34.29,5.08; E29 -35.56,5.08; E30 -36.83,5.08; E31 -38.1,5.08; E32 -39.37,5.08; E33 -40.64,5.08; E34 -41.91,5.08; E35 -43.18,5.08; E36 -44.45,5.08; E37 -45.72,5.08; E38 -46.99,5.08; E39 -48.26,5.08; E40 -49.53,5.08; F1 0,6.35; F2 -1.27,6.35; F3 -2.54,6.35; F4 -3.81,6.35; F5 -5.08,6.35; F6 -6.35,6.35; F7 -7.62,6.35; F8 -8.89,6.35; F9 -10.16,6.35; F10 -11.43,6.35; F11 -12.7,6.35; F12 -13.97,6.35; F13 -15.24,6.35; F14 -16.51,6.35; F15 -17.78,6.35; F16 -19.05,6.35; F17 -20.32,6.35; F18 -21.59,6.35; F19 -22.86,6.35; F20 -24.13,6.35; F21 -25.4,6.35; F22 -26.67,6.35; F23 -27.94,6.35; F24 -29.21,6.35; F25 -30.48,6.35; F26 -31.75,6.35; F27 -33.02,6.35; F28 -34.29,6.35; F29 -35.56,6.35; F30 -36.83,6.35; F31 -38.1,6.35; F32 -39.37,6.35; F33 -40.64,6.35; F34 -41.91,6.35; F35 -43.18,6.35; F36 -44.45,6.35; F37 -45.72,6.35; F38 -46.99,6.35; F39 -48.26,6.35; F40 -49.53,6.35; G1 0,7.62; G2 -1.27,7.62; G3 -2.54,7.62; G4 -3.81,7.62; G5 -5.08,7.62; G6 -6.35,7.62; G7 -7.62,7.62; G8 -8.89,7.62; G9 -10.16,7.62; G10 -11.43,7.62; G11 -12.7,7.62; G12 -13.97,7.62; G13 -15.24,7.62; G14 -16.51,7.62; G15 -17.78,7.62; G16 -19.05,7.62; G17 -20.32,7.62; G18 -21.59,7.62; G19 -22.86,7.62; G20 -24.13,7.62; G21 -25.4,7.62; G22 -26.67,7.62; G23 -27.94,7.62; G24 -29.21,7.62; G25 -30.48,7.62; G26 -31.75,7.62; G27 -33.02,7.62; G28 -34.29,7.62; G29 -35.56,7.62; G30 -36.83,7.62; G31 -38.1,7.62; G32 -39.37,7.62; G33 -40.64,7.62; G34 -41.91,7.62; G35 -43.18,7.62; G36 -44.45,7.62; G37 -45.72,7.62; G38 -46.99,7.62; G39 -48.26,7.62; G40 -49.53,7.62; H1 0,8.89; H2 -1.27,8.89; H3 -2.54,8.89; H4 -3.81,8.89; H5 -5.08,8.89; H6 -6.35,8.89; H7 -7.62,8.89; H8 -8.89,8.89; H9 -10.16,8.89; H10 -11.43,8.89; H11 -12.7,8.89; H12 -13.97,8.89; H13 -15.24,8.89; H14 -16.51,8.89; H15 -17.78,8.89; H16 -19.05,8.89; H17 -20.32,8.89; H18 -21.59,8.89; H19 -22.86,8.89; H20 -24.13,8.89; H21 -25.4,8.89; H22 -26.67,8.89; H23 -27.94,8.89; H24 -29.21,8.89; H25 -30.48,8.89; H26 -31.75,8.89; H27 -33.02,8.89; H28 -34.29,8.89; H29 -35.56,8.89; H30 -36.83,8.89; H31 -38.1,8.89; H32 -39.37,8.89; H33 -40.64,8.89; H34 -41.91,8.89; H35 -43.18,8.89; H36 -44.45,8.89; H37 -45.72,8.89; H38 -46.99,8.89; H39 -48.26,8.89; H40 -49.53,8.89; J1 0,10.16; J2 -1.27,10.16; J3 -2.54,10.16; J4 -3.81,10.16; J5 -5.08,10.16; J6 -6.35,10.16; J7 -7.62,10.16; J8 -8.89,10.16; J9 -10.16,10.16; J10 -11.43,10.16; J11 -12.7,10.16; J12 -13.97,10.16; J13 -15.24,10.16; J14 -16.51,10.16; J15 -17.78,10.16; J16 -19.05,10.16; J17 -20.32,10.16; J18 -21.59,10.16; J19 -22.86,10.16; J20 -24.13,10.16; J21 -25.4,10.16; J22 -26.67,10.16; J23 -27.94,10.16; J24 -29.21,10.16; J25 -30.48,10.16; J26 -31.75,10.16; J27 -33.02,10.16; J28 -34.29,10.16; J29 -35.56,10.16; J30 -36.83,10.16; J31 -38.1,10.16; J32 -39.37,10.16; J33 -40.64,10.16; J34 -41.91,10.16; J35 -43.18,10.16; J36 -44.45,10.16; J37 -45.72,10.16; J38 -46.99,10.16; J39 -48.26,10.16; J40 -49.53,10.16; K1 0,11.43; K2 -1.27,11.43; K3 -2.54,11.43; K4 -3.81,11.43; K5 -5.08,11.43; K6 -6.35,11.43; K7 -7.62,11.43; K8 -8.89,11.43; K9 -10.16,11.43; K10 -11.43,11.43; K11 -12.7,11.43; K12 -13.97,11.43; K13 -15.24,11.43; K14 -16.51,11.43; K15 -17.78,11.43; K16 -19.05,11.43; K17 -20.32,11.43; K18 -21.59,11.43; K19 -22.86,11.43; K20 -24.13,11.43; K21 -25.4,11.43; K22 -26.67,11.43; K23 -27.94,11.43; K24 -29.21,11.43; K25 -30.48,11.43; K26 -31.75,11.43; K27 -33.02,11.43; K28 -34.29,11.43; K29 -35.56,11.43; K30 -36.83,11.43; K31 -38.1,11.43; K32 -39.37,11.43; K33 -40.64,11.43; K34 -41.91,11.43; K35 -43.18,11.43; K36 -44.45,11.43; K37 -45.72,11.43; K38 -46.99,11.43; K39 -48.26,11.43; K40 -49.53,11.43 | hole 1.27: 2.426,2.667; -51.956,5.715
SMA-SMD = smd 1.73 x 1.73: 1 0,0 | smd 2.35 x 1.9: 2@1 -2.375,2.6; 2@2 -2.375,-2.6; 2@3 2.375,-2.6; 2@4 2.375,2.6 | smd 1.5 x 3.4: 2@5 -2.8,0; 2@6 2.8,0
SJW = smd 1.27 x 2.54: 1 -1.27,0; 2 1.27,0
W237-102 = drill 1.194 long: 1 -2.5,-1.27; 2 2.5,-1.27
JP2 = drill 0.914 long: 1 -2.54,0; 2 0,0; 3 2.54,0
0402 = smd 0.7 x 0.6: 1 -0.6,0; 2 0.6,0
R0603 = smd 1 x 1.1: 1 -0.85,0; 2 0.85,0
0805 = smd 1.2 x 1: 1 -1.2,0; 2 1.2,0
CHIP-LED0805 = smd 1.2 x 1.2: A 0,-1.05; C 0,1.05
SML0603 = smd 0.8 x 0.8: A 0.75,0; C -0.75,0
QSE-060-01 = smd 0.5 x 3: 1 0.019,0; 2 0.019,5.601; 3 0.819,0; 4 0.819,5.601; 5 1.619,0; 6 1.619,5.601; 7 2.419,0; 8 2.419,5.601; 9 3.22,0; 10 3.22,5.601; 11 4.02,0; 12 4.02,5.601; 13 4.82,0; 14 4.82,5.601; 15 5.62,0; 16 5.62,5.601; 17 6.42,0; 18 6.42,5.601; 19 7.22,0; 20 7.22,5.601; 21 8.02,0; 22 8.02,5.601; 23 8.82,0; 24 8.82,5.601; 25 9.62,0; 26 9.62,5.601; 27 10.42,0; 28 10.42,5.601; 29 11.22,0; 30 11.22,5.601; 31 12.021,0; 32 12.021,5.601; 33 12.821,0; 34 12.821,5.601; 35 13.621,0; 36 13.621,5.601; 37 14.421,0; 38 14.421,5.601; 39 15.221,0; 40 15.221,5.601; 41 20.022,0; 42 20.022,5.601; 43 20.822,0; 44 20.822,5.601; 45 21.622,0; 46 21.622,5.601; 47 22.422,0; 48 22.422,5.601; 49 23.222,0; 50 23.222,5.601; 51 24.022,0; 52 24.022,5.601; 53 24.822,0; 54 24.822,5.601; 55 25.622,0; 56 25.622,5.601; 57 26.422,0; 58 26.422,5.601; 59 27.223,0; 60 27.223,5.601; 61 28.023,0; 62 28.023,5.601; 63 28.823,0; 64 28.823,5.601; 65 29.623,0; 66 29.623,5.601; 67 30.423,0; 68 30.423,5.601; 69 31.223,0; 70 31.223,5.601; 71 32.023,0; 72 32.023,5.601; 73 32.823,0; 74 32.823,5.601; 75 33.623,0; 76 33.623,5.601; 77 34.423,0; 78 34.423,5.601; 79 35.224,0; 80 35.224,5.601; 81 40.024,0; 82 40.024,5.601; 83 40.824,0; 84 40.824,5.601; 85 41.624,0; 86 41.624,5.601; 87 42.424,0; 88 42.424,5.601; 89 43.224,0; 90 43.224,5.601; 91 44.025,0; 92 44.025,5.601; 93 44.825,0; 94 44.825,5.601; 95 45.625,0; 96 45.625,5.601; 97 46.425,0; 98 46.425,5.601; 99 47.225,0; 100 47.225,5.601; 101 48.025,0; 102 48.025,5.601; 103 48.825,0; 104 48.825,5.601; 105 49.625,0; 106 49.625,5.601; 107 50.425,0; 108 50.425,5.601; 109 51.225,0; 110 51.225,5.601; 111 52.026,0; 112 52.026,5.601; 113 52.826,0; 114 52.826,5.601; 115 53.626,0; 116 53.626,5.601; 117 54.426,0; 118 54.426,5.601; 119 55.226,0; 120 55.226,5.601 | smd 4.21 x 1.016: GND1 1.315,2.781; GND2 5.505,2.781; GND3 9.697,2.781; GND4 13.887,2.781; GND5 21.317,2.781; GND6 25.508,2.781; GND7 29.699,2.781; GND8 33.89,2.781; GND9 41.319,2.781; GND10 45.511,2.781; GND11 49.702,2.781; GND12 53.892,2.781 | hole 0.8: -2.381,5.372; 57.626,5.372
RESC1005X40N = smd 0.66 x 0.61: 1 -0.584,0; 2 0.584,0
SJ_2 = smd 1.168 x 1.6: 1 -1.524,0; 2 0,0; 3 1.524,0
SJ = smd 1.168 x 1.6: 1 -0.762,0; 2 0.762,0
TP10R = smd 1 x 1: TP 0,0
TP06R = smd 0.6 x 0.6: TP 0,0
DQA10 = smd 0.559 x 0.305: 1 -0.41,1; 2 -0.41,0.5; 4 -0.41,-0.5; 5 -0.41,-1; 6 0.41,-1; 7 0.41,-0.5; 9 0.41,0.5; 10 0.41,1 | smd 0.559 x 0.406: 3 -0.41,0; 8 0.41,0
RGZ48_5P6X5P6 = smd 0.838 x 0.279: 1 -3.475,2.75; 2 -3.475,2.25; 3 -3.475,1.75; 4 -3.475,1.25; 5 -3.475,0.75; 6 -3.475,0.25; 7 -3.475,-0.25; 8 -3.475,-0.75; 9 -3.475,-1.25; 10 -3.475,-1.75; 11 -3.475,-2.25; 12 -3.475,-2.75; 25 3.475,-2.75; 26 3.475,-2.25; 27 3.475,-1.75; 28 3.475,-1.25; 29 3.475,-0.75; 30 3.475,-0.25; 31 3.475,0.25; 32 3.475,0.75; 33 3.475,1.25; 34 3.475,1.75; 35 3.475,2.25; 36 3.475,2.75 | smd 0.279 x 0.838: 13 -2.751,-3.475; 14 -2.251,-3.475; 15 -1.75,-3.475; 16 -1.25,-3.475; 17 -0.75,-3.475; 18 -0.25,-3.475; 19 0.25,-3.475; 20 0.75,-3.475; 21 1.25,-3.475; 22 1.75,-3.475; 23 2.251,-3.475; 24 2.751,-3.475; 37 2.751,3.475; 38 2.251,3.475; 39 1.75,3.475; 40 1.25,3.475; 41 0.75,3.475; 42 0.25,3.475; 43 -0.25,3.475; 44 -0.75,3.475; 45 -1.25,3.475; 46 -1.75,3.475; 47 -2.251,3.475; 48 -2.751,3.475 | smd 5.588 x 5.588: 49 0,0
PW24 = smd 1.676 x 0.356: 1 -2.819,3.575; 2 -2.819,2.925; 3 -2.819,2.275; 4 -2.819,1.625; 5 -2.819,0.975; 6 -2.819,0.325; 7 -2.819,-0.325; 8 -2.819,-0.975; 9 -2.819,-1.625; 10 -2.819,-2.275; 11 -2.819,-2.925; 12 -2.819,-3.575; 13 2.819,-3.575; 14 2.819,-2.925; 15 2.819,-2.275; 16 2.819,-1.625; 17 2.819,-0.975; 18 2.819,-0.325; 19 2.819,0.325; 20 2.819,0.975; 21 2.819,1.625; 22 2.819,2.275; 23 2.819,2.925; 24 2.819,3.575
SD-47272 = smd 0.28 x 2.4: P$1 5.5,14.6; P$2 5,14.6; P$3 4.5,14.6; P$4 4,14.6; P$5 3.5,14.6; P$6 3,14.6; P$7 2.5,14.6; P$8 2,14.6; P$9 1.5,14.6; P$10 1,14.6; P$11 0.5,14.6; P$12 0,14.6; P$13 -0.5,14.6; P$14 -1,14.6; P$15 -1.5,14.6; P$16 -2,14.6; P$17 -2.5,14.6; P$18 -3,14.6; P$19 -3.5,14.6; P$20 -4,14.6 | drill 0.635 pad 1.27 offset: P$21 -8.25,4.9; P$22 -8.25,11.05; P$23 8.25,11; P$24 8.25,4.9 | hole 1.4: 0,4.3
DBV5 = smd 1.016 x 0.559: 1 -1.118,0.95; 2 -1.118,0; 3 -1.118,-0.95; 4 1.118,-0.95; 5 1.118,0.95

## Placement (x,y rotation side)
C100  100nF  [CAPC1005X60N]  60.45,57.99 270 bottom
C101  100nF  [CAPC1005X60N]  61.47,57.99 270 bottom
C102  1uF  [CAPC1005X60N]  40.18,41.2 180 bottom
C201  100nF  [CAPC1005X60N]  101.3,52.22 270 bottom
C202  100nF  [CAPC1005X60N]  98.15,52.22 270 bottom
C203  100nF  [CAPC1005X60N]  91.85,52.22 270 bottom
C204  100nF  [CAPC1005X60N]  95,52.22 270 bottom
C205  100nF  [CAPC1005X60N]  100.38,52.22 270 bottom
C206  100nF  [CAPC1005X60N]  97.23,52.22 270 bottom
C207  100nF  [CAPC1005X60N]  87.38,60.25 270 bottom
C208  100nF  [CAPC1005X60N]  90.93,52.22 270 bottom
C209  100nF  [CAPC1005X60N]  86.31,60.25 270 bottom
C210  100nF  [CAPC1005X60N]  94.08,52.22 270 bottom
C211  100nF  [CAPC1005X60N]  89.79,65.65 0 bottom
C212  100nF  [CAPC1005X60N]  100.69,65.63 180 bottom
C213  100nF  [CAPC1005X60N]  100.28,58.93 270 bottom
C214  100nF  [CAPC1005X60N]  91.03,58.52 180 bottom
C215  100nF  [CAPC1005X60N]  90.12,62.69 270 bottom
C216  1uF  [CAPC1005X60N]  101.1,64.62 0 bottom
C217  100nF  [CAPC1005X60N]  97.28,69.29 270 bottom
C218  100nF  [CAPC1005X60N]  99.53,69.29 270 bottom
C219  100nF  [CAPC1005X60N]  94.95,69.29 270 bottom
C220  100nF  [CAPC1005X60N]  92.62,69.29 270 bottom
C221  1uF  [CAPC1005X60N]  89.76,64.52 180 bottom
C222  100nF  [CAPC1005X60N]  98.6,69.29 270 bottom
C223  100nF  [CAPC1005X60N]  96.34,69.29 270 bottom
C224  100nF  [CAPC1005X60N]  91.69,69.29 270 bottom
C225  100nF  [CAPC1005X60N]  94.01,69.29 270 bottom
C226  1uF  [CAPC1005X60N]  108.94,64.74 0 bottom
C301  10nF  [CAPC1005X60N]  76.72,74.53 270 bottom
C302  10nF  [CAPC1005X60N]  75.49,74.54 270 bottom
C303  10uF  [CAPC1608X85N]  74.08,74.99 270 bottom
C304  10uF  [CAPC1608X85N]  72.44,74.99 270 bottom
C305  10nF  [CAPC1005X60N]  83.27,56.4 90 bottom
C306  1nF  [CAPC1005X60N]  77.94,74.54 270 bottom
C307  1nF  [CAPC1005X60N]  79.16,74.54 270 bottom
C308  10uF  [CAPC1608X85N]  84.59,56.1 90 bottom
C309  100nF  [CAPC1005X60N]  76.25,68.22 90 bottom
C310  1nF  [CAPC1005X60N]  74.98,68.22 90 bottom
C311  100nF  [CAPC1005X60N]  76.21,63.94 270 bottom
C312  1nF  [CAPC1005X60N]  74.99,63.94 270 bottom
C313  10uF  [CAPC1608X85N]  10.06,14.22 180 bottom
C314  100nF  [CAPC1005X60N]  78.89,60.35 0 bottom
C315  10nF  [CAPC1608X85N]  10.1,16.32 180 bottom
C316  10nF  [CAPC1005X60N]  77.17,59.23 180 bottom
C317  10nF  [CAPC1005X60N]  77.17,58.09 180 bottom
C318  1uF  [CAPC1005X60N]  107.85,68.43 90 bottom
C319  10uF  [CAPC1608X85N]  138.93,16.62 270 bottom
C320  1nF  [CAPC1005X60N]  78.89,58.06 0 bottom
C321  10nF  [CAPC1608X85N]  136.78,16.64 270 bottom
C322  1nF  [CAPC1005X60N]  78.89,59.21 0 bottom
C323  1uF  [CAPC1005X60N]  77.18,60.36 180 bottom
C324  1uF  [CAPC1005X60N]  78.89,56.93 0 bottom
C325  10uF  [CAPC1608X85N]  137.16,62.59 270 bottom
C326  1uF  [CAPC1005X60N]  77.62,82.4 270 bottom
C327  10nF  [CAPC1608X85N]  138.79,62.59 270 bottom
C328  10uF  [CAPC1608X85N]  12.7,62.59 270 bottom
C329  1uF  [CAPC1005X60N]  112.83,67.36 270 bottom
C330  1uF  [CAPC1005X60N]  112.98,82.7 270 bottom
C331  10nF  [CAPC1608X85N]  14.22,62.59 270 bottom
D300  BAS21W  [SOT65P210X100-3N]  70.51,77.84 270 bottom
D301  3.6V  [SMB]  70.71,68.68 270 bottom
D302  BAS21W  [SOT65P210X100-3N]  44.35,78.89 180 bottom
D303  BAS21W  [SOT65P210X100-3N]  110.67,71.28 0 bottom
D304  BAS21W  [SOT65P210X100-3N]  115.14,66.9 0 bottom
F301  PTC_0A5  [SMD-0805]  61.9,73.15 180 bottom
FID100  [FIDUTIAL]  10.79,9.53 0 top
FID101  [FIDUTIAL]  103.5,67.31 0 top
FID102  [FIDUTIAL]  73.03,6.35 0 top
FID103  [FIDUTIAL]  13.97,69.22 0 top
FID104  [FIDUTIAL]  26.04,6.99 0 top
FID105  [FIDUTIAL]  125.73,5.08 0 top
FID106  [FIDUTIAL]  76.2,80.01 0 top
FID107  [FIDUTIAL]  45.47,41.35 0 top
FID108  [FIDUTIAL]  119.38,64.77 0 top
H1  MOUNT-PAD-ROUND3.2  [3,2-PAD]  6.35,5.08 0 top
H2  MOUNT-PAD-ROUND3.2  [3,2-PAD]  6.35,83.82 0 top
H3  MOUNT-PAD-ROUND3.2  [3,2-PAD]  139.7,5.08 0 top
H4  MOUNT-PAD-ROUND3.2  [3,2-PAD]  139.7,83.82 0 top
J100_FMC:FMC1  >NAME  [SEAF-40-10]  102.67,40.81 180 bottom
J101  GBCTCLK1 N  [SMA-SMD]  53.85,58.42 270 bottom
J102  GBCTCLK1_P  [SMA-SMD]  68.07,58.42 90 bottom
J300  [SJW]  42.3,75.13 0 bottom
J301  [SJW]  42.29,71.86 0 bottom
J302  [W237-102]  52.58,83.44 0 bottom
JP301  3V3_EXT  [JP2]  49.66,73.28 270 bottom
L301  FB  [0402]  80.87,71.22 90 bottom
L302  FILT  [R0603]  75.77,70.8 90 bottom
L303  FB  [0805]  56.21,73.18 0 bottom
L304  FB  [0805]  56.18,71.63 0 bottom
L305  FILT  [R0603]  77.93,69.04 270 bottom
L306  FILT  [R0603]  77.99,65.82 90 bottom
L307  FILT  [R0603]  77.94,62.69 270 bottom
LED301  GREEN  [CHIP-LED0805]  66.55,81.79 0 bottom
LED302  GREEN  [CHIP-LED0805]  61.26,81.18 0 bottom
LED303  GREEN  [CHIP-LED0805]  41.05,82.19 0 bottom
LED304  GREEN  [CHIP-LED0805]  79.15,82.19 0 bottom
LED305  RED  [SML0603]  111.66,82.8 270 bottom
QSE_J401  EXP1  [QSE-060-01]  127.43,65.25 270 top
QSE_J402  EXP2  [QSE-060-01]  17.43,65.25 270 top
R100  1M  [RESC1005X40N]  39.83,42.42 0 bottom
R201  51R  [RESC1005X40N]  87.38,57.52 90 bottom
R202  51R  [RESC1005X40N]  86.31,57.52 270 bottom
R203  1.5K  [RESC1005X40N]  106.06,64.52 270 bottom
R204  1.5K  [RESC1005X40N]  102.41,64.52 270 bottom
R205  1.5K  [RESC1005X40N]  103.32,64.51 270 bottom
R206  1.5K  [RESC1005X40N]  104.24,64.51 270 bottom
R207  1.5K  [RESC1005X40N]  105.15,64.51 270 bottom
R208  1M  [RESC1005X40N]  85.04,62.99 270 bottom
R209  10K  [RESC1005X40N]  86.16,62.97 90 bottom
R210  10K  [RESC1005X40N]  87.39,62.95 90 bottom
R211  1M  [RESC1005X40N]  88.73,68.4 180 bottom
R212  100K  [RESC1005X40N]  81.99,81.74 180 bottom
R213  200K  [RESC1005X40N]  107.49,65.74 90 bottom
R214  100K  [RESC1005X40N]  103.43,75.9 270 bottom
R301  2.49K  [RESC1005X40N]  80.87,68.99 270 bottom
R302  1.5K  [RESC1005X40N]  80.89,66.41 270 bottom
R303  51R  [RESC1005X40N]  62.89,79.25 270 bottom
R304  51R  [RESC1005X40N]  64.41,79.25 90 bottom
R305  51R  [RESC1005X40N]  59.54,79.76 270 bottom
R306  51R  [RESC1005X40N]  59.54,82.19 270 bottom
R307  51R  [RESC1005X40N]  40.44,78.64 270 bottom
R308  51R  [RESC1005X40N]  39.12,79.86 270 bottom
R309  51R  [RESC1005X40N]  85.55,67.87 270 bottom
R310  51R  [RESC1005X40N]  84.33,67.87 270 bottom
R311  51R  [RESC1005X40N]  111.62,74.89 270 bottom
SJ200  DP_CAD_PULL  [SJ_2]  104.95,72.95 180 bottom
SJ201  DP_CAD_TO_FMC  [SJ]  113.59,52.73 0 bottom
TP1  +3v3  [TP10R]  81.66,75.44 0 bottom
TP2  +1v8  [TP10R]  114.71,69.09 0 bottom
TP3  +3v3_RX  [TP10R]  73.71,61.85 270 bottom
TP4  AUX_BIAS  [TP10R]  81.09,56.71 0 bottom
TP5  LOOP0_N  [TP06R]  81.86,49.19 0 bottom
TP6  LOOP0_P  [TP06R]  83.13,49.19 0 bottom
TP7  GND  [TP06R]  84.53,49.99 0 bottom
TP8  GND  [TP06R]  80.47,49.99 0 bottom
U201  TPD4S010_DQA_10  [DQA10]  88.85,71.02 90 bottom
U202  SN75DP130  [RGZ48_5P6X5P6]  95.55,62.31 0 bottom
U203  TPD4S010_DQA_10  [DQA10]  97.16,72.54 270 bottom
U204  SN74GTL2010  [PW24]  111.02,60.02 0 bottom
U205  TPD4S010_DQA_10  [DQA10]  94.16,72.54 270 bottom
U206  DP0_IN  [SD-47272]  92.91,89.83 180 bottom
U303  LP5907MFX-1.8  [DBV5]  110.24,67.89 180 bottom
U$2  [PASS-ROUND]  107.75,46.02 0 top
U$3  [PASS-ROUND]  133.35,3.17 0 top
U$4  [PASS-ROUND]  15.24,3.17 0 top
U$5  [PASS-ROUND]  15.24,73.03 0 top
U$6  [PASS-ROUND]  133.35,73.03 0 top
U$8  [ALIGNMENT]  -6.35,-6.35 0 top  (outside the outline)
U$9  [ALIGNMENT]  -6.35,95.25 0 top  (outside the outline)
U$10  [ALIGNMENT]  152.4,95.25 0 top  (outside the outline)
U$11  [ALIGNMENT]  152.4,-6.35 0 top  (outside the outline)

## Tracks (layer width: path | path; a pad name or v marks a point on that pad's centre or on a via)
1V8_LED  (via drill 0.2 pad 0.46 layers 8-16)
  GND_8 0.152: v111.62,76.29 v111.67,81.36
  Bottom_GND_SIG 0.152: R311.1 v111.62,76.29 | v111.67,81.36 LED305.A 111.9,82.3 C330.2
3V3_EXP_JP
  Bottom_GND_SIG 0.254: J302.1 57.09,80.16 58.01,80.16 59,79.17 R305.2
  Bottom_GND_SIG 1.27: J302.1 55.07,82.16 55.07,78.33 52.53,75.79 49.48,75.79 49.51,75.82 | D302.3 47.35,77.32 49.51,75.82 | 49.51,75.82 JP301.1
3V3_IN_FILTER_TO_FUSE
  Bottom_GND_SIG 0.102: L304.1 57.41,71.65
  Bottom_GND_SIG 0.762: 57.41,71.65 L303.1
  Bottom_GND_SIG 1.27: L303.1 57.66,73.14 F301.1
3V3_INT_JP
  Bottom_GND_SIG 1.27: J300.1 J301.1 44.38,70.71 49.78,70.71 49.81,70.74 | 49.89,70.81 49.81,70.74 | 49.81,70.74 JP301.3
3V3_INT_LED
  Bottom_GND_SIG 0.152: R308.1 39.75,81.08 40.84,81.08 40.91,81.14 LED303.A
3V3_RX  (via drill 0.2 pad 0.46 layers 7-16, 0.25 pad 0.64 layers 7-16)
  7_SIG4 0.254: 98.35,65.33 98.25,65.64 98.24,65.64 | 92.76,65.23 92.79,65.2 | 92.79,65.2 93.11,65.2 93.17,65.53 | v99.45,59 98.96,59.64 | 98.45,59.64 | v91.03,65.43 91.85,65.43 92.07,65.2 92.79,65.2 | 84.94,66.34 v84.94,65.63 | v99.52,65.66 100.51,65.66 101.09,66.24 v102.51,66.24
  7_SIG4 0.279: 98.47,65.65 98.24,65.64 | 97.54,65.63 97.51,65.66
  7_SIG4 0.406: v90.68,59.46 92.19,59.49 92.19,59.64 98.45,59.64 | v90.88,63.06 92.76,63.09 92.76,65.23 | 98.96,59.64 98.45,59.64
  7_SIG4 0.61: 98.96,59.64 98.55,60.05 98.55,62.38 98.75,62.59
  7_SIG4 0.635: v99.97,62.48 98.75,62.59 98.47,62.87 98.47,65.65 v99.52,65.66 | 98.24,65.64 97.54,65.63 | 98.35,65.33 91.54,65.43 v91.03,65.43 90.02,65.43 89.1,66.34 84.94,66.34 82.9,66.34 80.11,63.56 v80.11,61.8 v79.4,61.8
  Bottom_GND_SIG 0.254: TP3.TP v80.11,61.8 | 77.98,61.8 L307.2 | U202.32 v90.88,63.06 90.84,63.09 | U202.36 v91.03,65.43 91.71,65.43 U202.36 | C214.1 90.68,58.57 | C213.1 100.06,59.56 U202.12 99.08,59.51 99.08,59.45 | 99.4,59.08 v99.45,59 | C211.1 91.49,65.65 U202.36 | v84.94,65.63 84.94,66.14 85.55,66.75 R309.2 | C317.2 77.6,58.12 | 78.44,58.12 78.44,58.01 | v102.51,66.24 102.51,65.11 R203.1 103.42,65.1 R204.1 104.33,65.1 R205.1 105.13,65.1 105.16,65.13 105.22,65.13 R206.1 106.16,65.09 R207.1 | C212.1 v99.52,65.66
  Bottom_GND_SIG 0.279: U202.25 91.83,59.45 | U202.1 v99.51,65.67 v99.52,65.66 | U202.6 99.84,62.56 v99.97,62.48
  Bottom_GND_SIG 0.406: C317.2 C316.2 77.58,59.24 C323.2 77.6,60.35 77.93,60.55 C314.2 C322.2 C320.2 C324.2 | 91.83,59.45 v90.68,59.46 90.68,58.57 | 90.84,63.09 C215.1 | 99.08,59.45 99.4,59.08 | 77.6,58.12 78.44,58.12
  Bottom_GND_SIG 0.635: L307.2 77.94,60.47 77.93,60.66 77.93,60.55 | v80.11,61.8 77.98,61.8
  pour 7_SIG4 (isolate 0.17, no thermals): 92.66,65.74 98.76,65.74 98.76,59.54 92.66,59.54
3V3_RX_FILT_S0
  Bottom_GND_SIG 0.406: C310.2 75.78,68.63 | 75.78,68.63 C309.2 | 75.78,68.63 75.78,69.38 75.77,69.39
  Bottom_GND_SIG 0.635: 75.79,68.89 75.77,68.91 75.77,69.39 L302.1 75.83,69.89 L305.1
3V3_RX_FILT_S1
  Bottom_GND_SIG 0.635: L306.2 77.98,68.14 L305.2
3V3_RX_FILT_S2
  Bottom_GND_SIG 0.406: C312.2 76.19,63.51 C311.2 L307.1
  Bottom_GND_SIG 0.635: L307.1 77.93,64.91 L306.1
3V3_RX_LED  (via drill 0.2 pad 0.46 layers 7-16)
  7_SIG4 0.152: v84.12,69.29 84.12,69.39 83.21,70.31 83.21,77.42 80.97,79.65 79.35,79.65 78.33,80.16 v78.33,80.26
  Bottom_GND_SIG 0.152: R310.1 84.33,69.09 v84.12,69.29 | v78.33,80.26 78.33,81.38 | 78.33,81.38 C326.2 | 78.33,81.38 78.88,81.38 LED304.A
3V3_TO_AUX_BIAS_POST_FILTER
  Bottom_GND_SIG 0.152: 80.91,69.6 R301.1
  Bottom_GND_SIG 0.254: L301.1 80.91,69.6
+1V8  (via drill 0.2 pad 0.46 layers 8-16, 0.25 pad 0.51 layers 8-16)
  GND_8 0.254: v113.54,66.39 113.64,70.56 112.77,71.94 112.76,71.93 v112.57,71.93
  Bottom_GND_SIG 0.203: R311.2 111.62,71.95 D303.1
  Bottom_GND_SIG 0.254: 113.78,62.95 U204.2 | v113.54,66.39 113.49,66.44 112.98,66.95 111.4,66.9 111.35,66.85 U303.5 | D304.3 114.18,68.56 TP2.TP | v112.57,71.93 v112.56,71.94 D303.1
  Bottom_GND_SIG 0.356: 115.14,62.95 113.78,62.95
  Bottom_GND_SIG 0.406: 115.14,62.95 115.28,63.54 115.14,64.36 111.96,65.84 111.96,66.95 | D304.3 113.59,66.9 | 113.59,66.9 113.54,66.85 v113.54,66.39 113.59,66.9 | 113.59,66.9 | 113.59,66.9 112.88,66.9 C329.2 111.96,66.95 | 111.3,66.95 111.96,66.95
+3V3  (via drill 0.2 pad 0.46 layers 8-16, 0.25 pad 0.61 layers 8-16)
  GND_8 0.254: v107.29,69.51 106.44,69.9
  GND_8 0.635: v106.38,67.26 106.38,68.38 106.44,69.9 106.43,71.22 106.43,71.35 105.56,72.21 105.56,80.11 103.98,81.29 99.47,81.32 97.17,78.74 88.8,78.64 84.73,74.27 v84.34,73.81 v84.26,73
  Bottom_GND_SIG 0.254: v84.26,73 84.87,71.48 84.91,70.02 84.92,70.01 86.37,69.07 86.83,68.56 R211.1 | U303.3 109.73,69.45 109.73,70.51 109.7,70.54 D303.3 | U303.1 108.4,66.94 108,66.55 R213.2 | 106.73,67 106.39,67.25 v106.38,67.26 | 80.87,72.95 80.97,73.05 84.43,73 83.52,73 | 79.16,73.11 79.96,73.04 | 78.03,73 78.64,73 | F301.2 62.93,73.83 62.89,78.23 R303.2
  Bottom_GND_SIG 0.406: U303.3 109.11,68.83 C318.2 107.19,69.49 v106.78,69.49 106.79,69.51 v107.29,69.51 | C307.2 79.16,73.11 | C306.2 78.03,73 | L301.2 80.87,73.06
  Bottom_GND_SIG 0.635: v106.38,67.26 R213.2 | TP1.TP 81.75,73.08 | C304.2 72.55,72.98 72.54,72.98 | C303.2 74.07,73.05 74.05,73.06 73.88,73.06 73.96,72.98 | C302.2 75.49,72.95 75.64,73.1 75.28,73.1 75.39,72.99 | C301.2 76.69,73.23 | 76.61,73.25 76.69,73.23 | 76.69,73.23 76.61,73.15 76.61,72.99 | L302.2 75.77,72.91 75.84,72.99
  Bottom_GND_SIG 1.27: F301.2 70.51,73.07 | 70.51,73.07 70.71,72.97 | 70.71,72.97 72.54,72.98 73.96,72.98 75.39,72.99 75.84,72.99 76.61,72.99 78.64,73 78.81,73 | 78.81,73 79.96,73.04 80.87,73.06 81.75,73.08 83.53,73 v84.34,73.81 | D300.3 70.51,73.07 | D301.C 70.71,72.97 | 78.81,73 83.52,73 84.38,73 84.43,72.95 84.43,73 84.43,73.66 84.33,73.76
AUX_BIAS  (via drill 0.25 pad 0.51 layers 3-16)
  3_SIG2 0.254: v81.57,66.98 81.58,66.95 | 81.58,66.95 81.69,66.95 | 81.58,66.95 82.91,65.94 82.91,59.54 v84.24,58.03
  Bottom_GND_SIG 0.254: R301.2 R302.1 81.44,66.99 v81.57,66.98 | C308.2 84.59,57.67 v84.24,58.03 | C308.2 C305.2 82.82,56.81 TP4.TP | C308.2 84.75,56.81 | C308.2 86.25,56.81 R202.2 R201.1
AUX_SRC_C_N  (via drill 0.2 pad 0.46 layers 5-16)
  5_SIG3 0.089: v90.53,60.25 90.37,60.4 87.01,60.4 86.72,60.69 86.72,60.91 86.36,61.2 86.31,61.25 v86.31,61.35 86.46,61.51 86.56,61.51 86.7,61.61 86.7,66.29 89.41,69 89.41,69.39 v89.2,69.8
  Bottom_GND_SIG 0.089: 86.14,62.41 86.31,62.24
  Bottom_GND_SIG 0.127: U206.P$17 90.41,74.03 90.73,73.51 90.73,73.22 89.42,71.92 U201.2 v89.2,69.8 | U202.27 90.94,60.56 v90.53,60.25 | 86.31,62.24 v86.31,61.35 C209.1
  Bottom_GND_SIG 0.254: R208.2 86.14,62.41 R209.1
AUX_SRC_C_P  (via drill 0.2 pad 0.46 layers 5-16)
  5_SIG3 0.089: v90.53,60.96 90.27,60.71 89.52,60.71 arc-90 89.26,60.97 arc90 89,61.23 88.81,61.23 arc90 88.55,60.97 arc-90 88.29,60.71 87.13,60.71 87.02,60.82 87.02,60.96 87.27,61.16 87.38,61.27 v87.38,61.35 87.38,61.49 87.33,61.54 87.01,61.68 87.01,66.17 89.71,68.87 89.71,69.6 v89.92,69.8
  Bottom_GND_SIG 0.089: 87.39,61.37 v87.38,61.35 | R211.2 89.32,68.49 89.92,69.09 v89.92,69.8
  Bottom_GND_SIG 0.127: U206.P$15 91.41,73.89 91.08,73.61 91.08,73.09 89.85,71.85 U201.1 v89.92,69.8 | U202.28 91.45,61.06 91.35,60.94 90.73,60.94 v90.53,60.96 | R210.1 87.39,61.37 | C207.1 v87.38,61.35
CAD_SRC  (via drill 0.2 pad 0.46 layers 3-16, 0.25 pad 0.46 layers 3-16, 0.25 pad 0.51)
  3_SIG2 0.127: v87.63,69.8 88.04,70.51 88.54,70.51 91.34,73.86 91.34,74.27 92.46,75.39 92.46,76.91 v92.35,77.01
  7_SIG4 0.254: v92.35,77.01 92.35,77.11 91.95,77.52 90.32,77.52 86.97,80.77 v82.6,80.77
  Bottom_GND_SIG 0.127: U201.4 88.35,70.31 87.88,70 87.63,69.95 v87.63,69.8
  Bottom_GND_SIG 0.254: U206.P$13 92.41,76.95 v92.35,77.01 | v82.6,80.77 82.55,81.7 R212.2
DP0_AUX_RX_DIFF_N  (via drill 0.2 pad 0.46 layers 5-16)
  5_SIG3 0.089: v86.36,59.13 86.69,58.8 86.69,50.94 83.46,47.71 83.46,37.13 83.77,36.83 87.17,36.83 87.3,36.7 87.3,33.34 87.61,33.03 90.93,33.03 91.06,32.91 91.06,32.66 v90.63,32.46
  Bottom_GND_SIG 0.089: C209.2 86.36,59.79 | v90.63,32.46 J100_FMC:FMC1.H11
  Bottom_GND_SIG 0.127: 86.36,59.79 v86.36,59.13 R202.1
DP0_AUX_RX_DIFF_P  (via drill 0.2 pad 0.46 layers 5-16)
  5_SIG3 0.089: v87.38,59.13 87,58.75 87,50.81 83.77,47.59 83.77,37.26 83.9,37.13 87.3,37.13 87.61,36.83 87.61,33.47 87.73,33.34 91.06,33.34 91.36,33.03 91.36,32.66 v91.85,32.51
  Bottom_GND_SIG 0.089: v91.85,32.51 J100_FMC:FMC1.H10
  Bottom_GND_SIG 0.127: C207.2 v87.38,59.13 R201.2
DP0_CAD  (via drill 0.2 pad 0.46 layers 9-16)
  9_POWER_GND 0.127: v80.47,38.91 79.81,38.29 79.81,36.02 80.26,35.56 80.77,35.56 81.08,35.26 81.08,34.85 81.18,34.75 81.9,34.45 83.03,34.45 83.52,34.04 83.52,33.63 83.72,33.43 84.05,33.43 84.56,32.92 84.73,32.92 84.94,32.72 84.94,32.41 86.06,31.42 86.06,29.47 89.13,26.4 103.38,26.4 115.32,38.34 115.62,53.24 v115.63,53.39
  Bottom_GND_SIG 0.127: v80.47,38.91 J100_FMC:FMC1.C19 | SJ201.1 114.97,52.73 v115.63,53.39
DP0_CAD_3V3  (via drill 0.2 pad 0.46 layers 5-16)
  5_SIG3 0.127: v101.5,60.55 101.5,61.27 102.41,62.18 102.41,64.21 103.73,65.53 103.73,66.24 104.75,67.26 104.75,70.1 104.44,70.41 104.44,70.92 v104.95,71.42
  Bottom_GND_SIG 0.127: 108.17,57.71 U204.15 104.2,57.74 v101.5,60.55 | 101.39,60.56 v101.5,60.55 | v101.5,60.55 U202.10 | v104.95,71.42 SJ200.2
DP0_CAD_JMP_IN
  Bottom_GND_SIG 0.127: SJ201.2 112.83,55.52 111.96,56.39 111.96,57 112.67,57.71 113.81,57.71 U204.10
DP0_HPD  (via drill 0.2 pad 0.46 layers 9-16)
  9_POWER_GND 0.127: v81.79,38.91 81.18,38.3 81.18,37.49 81.79,36.88 81.99,36.88 82.4,36.47 82.4,36.07 82.7,35.76 87,35.76 87.58,35.19 87.58,29.39 89.88,27.1 102.65,27.1 114.61,39.06 114.61,55.68 v115.42,56.49
  Bottom_GND_SIG 0.127: J100_FMC:FMC1.C18 v81.79,38.91 | v115.42,56.49 115.42,56.59 114.91,57.1 113.79,57.1 113.79,57.09 U204.11
DP0_HPD_3V3  (via drill 0.2 pad 0.46 layers 9-16, 0.2 pad 0.51 layers 9-16)
  9_POWER_GND 0.127: v105.16,63.09 105.16,60.31 103.06,58.22 v102.72,58.22
  Bottom_GND_SIG 0.127: U204.14 103.84,57.09 v102.72,58.22 100.89,60.05 99.04,60.05 U202.11 | R207.2 v105.15,63.1 v105.16,63.09
DP0_IN0_N
  Bottom_GND_SIG 0.127: C220.2 92.3,68.57 92.3,68.15 92.43,68.02 93.32,68.02 93.73,67.61 93.73,66.34 93.8,66.27 U202.39
DP0_IN0_P
  Bottom_GND_SIG 0.127: C224.2 92,68.57 92,68 92.28,67.72 93.14,67.72 93.42,67.44 93.42,66.34 93.3,66.23 U202.38
DP0_IN1_N
  Bottom_GND_SIG 0.127: C219.2 94.94,68.81 94.59,68.45 94.59,68.2 94.72,68.07 95.22,68.07 95.95,67.34 95.95,66.98 95.31,66.34 U202.42
DP0_IN1_P
  Bottom_GND_SIG 0.127: C225.2 94,68.73 94.28,68.45 94.28,68.05 94.56,67.77 95.07,67.77 95.6,67.24 95.6,67.06 94.81,66.27 U202.41
DP0_IN2_N
  Bottom_GND_SIG 0.127: U202.45 96.81,66.42 96.72,66.5 96.72,66.62 97.05,66.95 97.41,66.95 97.7,67.24 97.7,67.78 97.41,68.07 97.08,68.07 96.95,68.2 96.95,68.56 C217.2
DP0_IN2_P
  Bottom_GND_SIG 0.127: U202.44 96.31,66.38 96.42,66.5 96.42,66.78 96.9,67.26 97.26,67.26 97.38,67.39 97.38,67.64 97.26,67.77 96.93,67.77 96.65,68.05 96.65,68.58 C223.2
DP0_IN3_N
  Bottom_GND_SIG 0.127: U202.48 98.31,66.44 98.51,66.65 99.19,66.65 99.62,67.09 99.62,67.88 99.21,68.29 99.21,68.57 C218.2
DP0_IN3_P
  Bottom_GND_SIG 0.127: U202.47 97.81,66.37 98.39,66.95 99.03,66.95 99.29,67.21 99.29,67.78 98.91,68.16 98.91,68.58 C222.2
DP0_LANE0_N  (via drill 0.2 pad 0.46 layers 8-16)
  GND_8 0.089: v91.85,50.9 91.85,50.7 91.54,50.39 91.54,49.24 92.3,48.48 92.3,47.09 arc-90 91.76,46.55 90.28,46.55 arc90 90.03,46.3 90.03,45.87 arc90 90.28,45.62 91.76,45.62 arc-90 92.3,45.08 92.3,42.1 92.35,41.41 92.05,41.1 91.58,41.1 91.1,41.6 v90.63,41.6
  Bottom_GND_SIG 0.089: 91.8,51.71 91.85,51.71 C203.2 91.8,51.82 91.54,51.56 91.54,51.05 91.69,50.9 v91.85,50.9
  Bottom_GND_SIG 0.127: J100_FMC:FMC1.A11 89.97,40.95 v90.63,41.6
DP0_LANE0_P  (via drill 0.2 pad 0.46 layers 8-16)
  GND_8 0.089: v91.86,41.62 92,41.74 92,42.35 arc90 91.76,42.6 91.46,42.6 arc-90 91.22,42.84 91.22,42.93 arc-90 91.46,43.17 91.76,43.17 arc90 92,43.41 92,43.5 arc90 91.76,43.74 91.46,43.74 arc-90 91.22,43.98 91.22,44.07 arc-90 91.46,44.31 91.76,44.31 arc90 92,44.55 92,45.08 arc90 91.76,45.32 90.28,45.32 arc-90 89.73,45.87 89.73,46.3 arc-90 90.28,46.85 91.76,46.85 arc90 92,47.09 92,48.35 91.24,49.11 91.24,50.39 90.93,50.7 v90.93,50.9
  Bottom_GND_SIG 0.089: C208.2 90.98,51.82 91.24,51.56 91.24,51.05 91.08,50.9 v90.93,50.9
  Bottom_GND_SIG 0.127: J100_FMC:FMC1.A10 v91.86,41.62
DP0_LANE1_N  (via drill 0.2 pad 0.46 layers 8-16)
  GND_8 0.089: v95,50.9 95,50.75 94.69,50.44 94.69,47.85 arc90 94.93,47.61 96.1,47.61 arc-90 96.65,47.07 96.65,46.24 arc-90 96.1,45.7 94.93,45.7 arc90 94.69,45.45 94.69,45.07 97.23,42.53 97.23,42 97.33,41.91 97.33,41.2 97.03,41.05 96.57,41.1 96.22,41.45 v95.86,41.55
  Bottom_GND_SIG 0.089: C204.2 94.92,51.82 94.69,51.59 94.69,51.07 94.86,50.9 v95,50.9
  Bottom_GND_SIG 0.102: J100_FMC:FMC1.A7 95.56,41.31 v95.86,41.55
DP0_LANE1_P  (via drill 0.2 pad 0.46 layers 8-16)
  GND_8 0.089: v94.08,50.9 94.08,50.75 94.39,50.44 94.39,47.85 arc90 94.93,47.31 96.1,47.31 arc-90 96.35,47.07 96.35,46.24 arc-90 96.1,46 94.93,46 arc90 94.39,45.45 94.39,44.95 95.3,44.04 arc-90 95.3,43.7 95.09,43.49 arc90 95.09,43.15 95.12,43.12 arc90 95.47,43.12 95.67,43.32 arc-90 96.01,43.32 96.04,43.29 arc-90 96.04,42.95 95.84,42.75 arc90 95.84,42.41 95.87,42.38 arc90 96.21,42.38 96.41,42.58 arc-90 96.75,42.58 96.93,42.41 96.93,41.91 v96.88,41.55
  Bottom_GND_SIG 0.089: C210.2 94.16,51.82 94.39,51.59 94.39,51.07 94.22,50.9 v94.08,50.9
  Bottom_GND_SIG 0.102: J100_FMC:FMC1.A6 v96.88,41.55
DP0_LANE2_N  (via drill 0.2 pad 0.46 layers 8-16)
  GND_8 0.089: v98.15,50.88 98.15,50.75 97.84,50.44 97.84,49.34 99.01,48.17 99.01,39.57 98.7,39.27 97.8,39.27 97.09,38.35 96.37,38.35 95.97,38.86 v95.66,38.86
  Bottom_GND_SIG 0.089: C202.2 98.04,51.82 97.85,51.63 97.85,51.08 98.06,50.88 v98.15,50.88
  Bottom_GND_SIG 0.102: J100_FMC:FMC1.C7 v95.66,38.86
DP0_LANE2_P  (via drill 0.2 pad 0.46 layers 8-16)
  GND_8 0.089: v97.23,50.88 97.23,50.75 97.54,50.44 97.54,49.21 98.7,48.04 98.7,44.45 arc-90 98.46,44.21 98.22,44.21 arc90 97.98,43.97 97.98,43.86 arc90 98.22,43.62 98.46,43.62 arc-90 98.7,43.38 98.7,43.27 arc-90 98.46,43.03 98.22,43.03 arc90 97.98,42.79 97.98,42.69 arc90 98.22,42.44 98.46,42.44 arc-90 98.7,42.2 98.7,39.7 98.58,39.57 97.62,39.57 97.07,38.86 v96.93,38.91
  Bottom_GND_SIG 0.089: C206.2 97.26,51.82 97.55,51.63 97.55,51.12 97.31,50.88 v97.23,50.88
  Bottom_GND_SIG 0.127: J100_FMC:FMC1.C6 v96.93,38.91
DP0_LANE3_N  (via drill 0.2 pad 0.46 layers 8-16)
  GND_8 0.089: v101.3,50.9 101.3,50.75 100.99,50.44 100.99,50.03 arc90 101.25,49.77 102.06,49.77 arc-90 102.63,49.21 102.63,48.78 arc-90 102.06,48.22 101.25,48.22 arc90 100.99,47.95 100.99,43.75 102.82,41.92 102.82,41.27 102.24,40.69 101.47,40.69 101.19,40.97 101.19,41.4 100.89,41.55 v100.74,41.55
  Bottom_GND_SIG 0.089: C201.2 100.99,51.61 100.99,51.08 101.17,50.9 v101.3,50.9
  Bottom_GND_SIG 0.127: J100_FMC:FMC1.A3 v100.74,41.55
DP0_LANE3_OUT0_N
  Bottom_GND_SIG 0.127: C203.1 91.85,52.78 91.54,53.09 91.54,54 arc90 91,54.55 90.94,54.55 arc-90 90.7,54.79 90.7,55.81 arc-90 90.94,56.05 91,56.05 arc90 91.54,56.59 91.54,56.63 91.76,56.84 92.81,56.84 93.73,57.76 93.73,58.28 93.8,58.36 U202.22
DP0_LANE3_OUT0_P
  Bottom_GND_SIG 0.127: C208.1 90.93,52.78 91.24,53.09 91.24,54 arc90 91,54.24 90.94,54.24 arc-90 90.4,54.79 90.4,55.81 arc-90 90.94,56.35 91,56.35 arc90 91.24,56.59 91.24,56.76 91.63,57.15 92.66,57.15 93.42,57.91 93.42,58.28 93.3,58.4 U202.23
DP0_LANE3_OUT1_N
  Bottom_GND_SIG 0.127: C204.1 95,52.78 94.69,53.09 94.69,53.47 arc90 94.14,54.01 94.02,54.01 arc-90 93.78,54.25 93.78,54.33 arc-90 94.02,54.57 94.14,54.57 arc90 94.69,55.12 94.69,55.19 arc90 94.14,55.74 94.02,55.74 arc-90 93.78,55.98 93.78,56.06 arc-90 94.02,56.3 94.14,56.3 arc90 94.69,56.84 94.69,57.09 95.2,57.59 95.2,58.27 95.31,58.37 U202.19
DP0_LANE3_OUT1_P
  Bottom_GND_SIG 0.127: C210.1 94.08,52.78 94.39,53.09 94.39,53.47 arc90 94.14,53.71 94.02,53.71 arc-90 93.47,54.25 93.47,54.33 arc-90 94.02,54.88 94.14,54.88 arc90 94.39,55.12 94.39,55.19 arc90 94.14,55.44 94.02,55.44 arc-90 93.47,55.98 93.47,56.06 arc-90 94.02,56.6 94.14,56.6 arc90 94.39,56.84 94.39,57.21 94.89,57.72 94.89,58.27 94.81,58.36 U202.20
DP0_LANE3_OUT2_N
  Bottom_GND_SIG 0.127: C202.1 98.15,52.98 98.09,53.05 97.84,53.14 97.84,53.24 arc90 97.3,53.78 97.24,53.78 arc-90 97,54.03 97,54.04 arc-90 97.24,54.28 97.3,54.28 arc90 97.84,54.83 97.84,54.85 arc90 97.3,55.39 97.23,55.39 arc-90 96.99,55.63 96.99,55.65 arc-90 97.23,55.89 97.3,55.89 arc90 97.84,56.44 97.84,56.86 96.81,57.91 96.81,57.94 U202.16
DP0_LANE3_OUT2_P
  Bottom_GND_SIG 0.127: C206.1 97.23,52.83 97.54,53.14 97.54,53.24 arc90 97.3,53.48 97.23,53.48 arc-90 96.69,54.03 96.69,54.04 arc-90 97.23,54.59 97.3,54.59 arc90 97.54,54.83 97.54,54.85 arc90 97.3,55.09 97.23,55.09 arc-90 96.69,55.63 96.69,55.65 arc-90 97.23,56.2 97.3,56.2 arc90 97.54,56.44 97.54,56.73 96.42,57.85 96.42,57.87 96.36,58.04 96.31,58.18 U202.17
DP0_LANE3_OUT3_N
  Bottom_GND_SIG 0.127: C201.1 101.3,52.88 100.99,53.19 100.99,53.34 arc-90 101.23,53.58 101.47,53.58 arc90 102.01,54.12 102.01,54.17 arc90 101.47,54.71 101.23,54.71 arc-90 100.99,54.95 100.99,55.08 98.2,57.87 98.2,58.27 98.31,58.38 U202.13
DP0_LANE3_OUT3_P
  Bottom_GND_SIG 0.127: C205.1 100.38,52.88 100.69,53.19 100.69,53.34 arc-90 101.23,53.88 101.47,53.88 arc90 101.71,54.12 101.71,54.17 arc90 101.47,54.41 101.23,54.41 arc-90 100.69,54.95 97.89,57.75 97.89,58.27 97.81,58.35 U202.14
DP0_LANE3_P  (via drill 0.2 pad 0.46 layers 8-16)
  GND_8 0.089: v100.38,50.9 100.38,50.75 100.69,50.44 100.69,50.03 arc90 101.25,49.47 102.06,49.47 arc-90 102.32,49.21 102.32,48.78 arc-90 102.06,48.52 101.25,48.52 arc90 100.69,47.95 100.69,43.62 100.96,43.35 arc-90 100.96,43.01 100.79,42.84 arc90 100.79,42.5 100.8,42.5 arc90 101.14,42.5 101.3,42.67 arc-90 101.64,42.67 102.51,41.8 102.51,41.43 102.08,41 101.62,41 101.5,41.12 101.5,41.4 v101.96,41.6
  Bottom_GND_SIG 0.089: C205.2 100.69,51.61 100.69,51.08 100.51,50.9 v100.38,50.9
  Bottom_GND_SIG 0.127: J100_FMC:FMC1.A2 v101.96,41.6
DP0_RX_ENA  (via drill 0.2 pad 0.46 layers 9-16)
  9_POWER_GND 0.089: 77.11,37.19 77.31,37.49
  9_POWER_GND 0.127: v58.93,33.83 59.54,34.44 74.27,34.44 74.78,34.95 74.78,35.66 74.98,35.87 75.79,35.87 76,36.07 76,36.98 76.2,37.19 77.11,37.19 | v113.79,54.76 113.79,39.49 102.57,28.27 90.07,28.27 88.7,29.65 88.7,35.11 86.82,36.98 82.65,36.98 82.4,37.24 82.4,39.27 82.14,39.52 78.89,39.52 78.64,39.27 78.64,38.41 77.31,38.41 77.31,37.49
  Bottom_GND_SIG 0.127: J100_FMC:FMC1.G36 v58.93,33.83 | v113.79,54.76 113.79,56.39 113.89,56.49 U204.12
DP0_RX_ENA_3V3  (via drill 0.2 pad 0.51 layers 5-16, 0.25 pad 0.46 layers 5-16)
  5_SIG3 0.127: v91.24,60.05 91.03,60.05 90.75,59.76 90.75,57.85 91.69,56.91 104.85,56.9 105.26,56.49 106.07,56.49 | 106.07,56.49 v106.98,56.49 | v106.07,63.09 106.07,56.49
  Bottom_GND_SIG 0.127: R203.2 v106.06,63.1 v106.07,63.09
  Bottom_GND_SIG 0.254: U202.26 92.07,60.05 v91.24,60.05 | v106.98,56.49 108.16,56.49 U204.13
DP0_RX_SENSE_N  (via drill 0.2 pad 0.46 layers 7-16)
  7_SIG4 0.089: v86.16,64.31 86.61,63.91 86.61,63.46 86.09,62.94 84.77,62.94 81.94,60.11 81.94,54.29 84.73,51.5 84.73,35.84 85.01,35.56 92.04,35.56 92.41,35.19 92.41,34.14 v92.05,33.83
  Bottom_GND_SIG 0.089: v92.05,33.83 J100_FMC:FMC1.G10
  Bottom_GND_SIG 0.127: R209.2 v86.16,64.31
DP0_RX_SENSE_P  (via drill 0.2 pad 0.46 layers 7-16)
  7_SIG4 0.089: v87.38,64.31 86.92,63.91 86.92,63.34 86.22,62.64 84.9,62.64 82.25,59.98 82.25,54.42 85.04,51.62 85.04,35.99 85.17,35.87 92.21,35.87 92.71,35.34 92.71,34.14 v93.17,33.93
  Bottom_GND_SIG 0.089: v93.17,33.93 J100_FMC:FMC1.G9
  Bottom_GND_SIG 0.127: R210.2 v87.38,64.31
DP0_SCL_CTL  (via drill 0.2 pad 0.46 layers 9-16)
  9_POWER_GND 0.102: 118.16,36.77 118.16,58.83 116.64,60.35 v115.21,60.35
  9_POWER_GND 0.127: 118.16,36.77 105.37,23.98 69.93,23.98 66.32,27.59 65.84,29.57 65.94,29.67 65.94,30.38 65.73,30.58 65.02,30.58 64.57,31.03 64.57,31.96 v65.23,32.61
  Bottom_GND_SIG 0.127: U204.6 v115.21,60.35
  Bottom_GND_SIG 0.203: v65.23,32.61 65.23,32.58 J100_FMC:FMC1.H31
  Bottom_GND_SIG 0.254: U204.6
DP0_SCL_CTL_3V3
  Bottom_GND_SIG 0.102: 101.91,62.18 101.91,63.43 R204.2
  Bottom_GND_SIG 0.127: U204.19 103.74,60.34 101.91,62.18 100.58,63.5 99.09,63.5 U202.4
DP0_SDA_CTL  (via drill 0.2 pad 0.46 layers 9-16)
  9_POWER_GND 0.127: v72.85,32.51 72.24,31.9 71.93,32.11 71.12,32.11 70.92,31.9 70.71,31.9 70.51,32.11 69.9,32.11 69.7,31.9 67.44,31.9 67.06,31.52 67.06,28.51 70.45,25.12 105.42,25.12 117.35,37.04 117.35,58.32 115.93,59.74 v115.82,59.74
  Bottom_GND_SIG 0.127: U204.7 115.78,59.7 v115.82,59.74 | v72.85,32.51 J100_FMC:FMC1.H25
DP0_SDA_CTL_3V3  (via drill 0.2 pad 0.46 layers 9-16, 0.2 pad 0.51 layers 9-16)
  9_POWER_GND 0.127: v103.33,63.09 103.33,61.79 102.59,61.06 v102.31,61.06
  Bottom_GND_SIG 0.102: v103.32,63.1 v103.33,63.09
  Bottom_GND_SIG 0.127: 108.16,59.74 U204.18 108.15,59.64 103.73,59.64 v102.31,61.06 102.21,61.16 100.32,63.06 U202.5 | R205.2 v103.32,63.1
DP_IN_LANE0_N
  Bottom_GND_SIG 0.127: U206.P$10 93.91,74.01 93.66,73.76 U205.2 93.66,71.85 92.39,70.68 92.39,70.12 92.62,69.89 C220.1
DP_IN_LANE0_P
  Bottom_GND_SIG 0.127: U206.P$12 92.91,74 93.16,73.76 U205.1 93.16,71.81 92,70.75 92,70.26 91.68,69.98 C224.1
DP_IN_LANE1_N
  Bottom_GND_SIG 0.127: U206.P$7 95.41,74.04 95.16,73.75 U205.5 95.15,71.84 95.15,71.8 94.98,71.64 | 95.05,71.7 94.98,71.64 | 94.98,71.64 94.64,71.28 94.64,71.2 94.94,70.89 94.94,70.33 94.67,70.05 94.67,69.97 C219.1
DP_IN_LANE1_P
  Bottom_GND_SIG 0.127: U206.P$9 94.41,74.05 94.66,73.81 U205.4 94.69,72.92 94.69,71.77 94.64,71.73 94.26,71.33 94.26,71.01 94.64,70.64 94.64,70.48 94.32,70.17 94.32,69.91 C225.1
DP_IN_LANE2_N
  Bottom_GND_SIG 0.127: C217.1 97.08,69.91 97.08,69.93 97.28,70.13 97.28,71.22 97.13,71.37 96.74,71.37 96.66,71.46 U203.2 96.66,73.68 96.91,73.94 U206.P$4
DP_IN_LANE2_P
  Bottom_GND_SIG 0.127: C223.1 96.55,69.91 96.93,70.3 96.93,70.95 96.86,71.03 96.55,71.06 96.25,71.36 96.16,71.94 U203.1 96.16,73.72 95.91,73.96 U206.P$6
DP_IN_LANE3_N
  Bottom_GND_SIG 0.127: C218.1 99.53,69.81 99.21,70 99.21,70.78 98.16,71.83 U203.5 98.16,73.72 98.41,74 U206.P$1
DP_IN_LANE3_P
  Bottom_GND_SIG 0.127: C222.1 98.91,70 98.91,70.65 97.66,71.9 U203.4 97.66,73.74 97.41,73.99 U206.P$3
EXP1_DIFF_CLK_IN_CLK2_N  (via drill 0.2 layers 1-7, 0.2 pad 0.46 layers 7-16)
  Top_SIG1 0.102: QSE_J401.44 v134.93,44.4
  7_SIG4 0.089: v134.93,44.4 134.11,44.4 133.86,44.65 123.51,44.65 113.23,34.38 113.23,30.11 108.78,25.65 108.51,25.65 arc90 108.25,25.4 108.25,22.03 arc-90 107.7,21.47 107.49,21.47 arc-90 106.93,22.03 106.93,25.4 arc90 106.68,25.65 106.48,25.65 arc90 106.22,25.4 106.22,22.03 arc-90 105.66,21.47 105.46,21.47 arc-90 104.9,22.03 104.9,25.4 arc90 104.65,25.65 104.45,25.65 arc90 104.19,25.4 104.19,22.03 arc-90 103.63,21.47 103.43,21.47 arc-90 102.87,22.03 102.87,25.4 arc90 102.62,25.65 102.41,25.65 arc90 102.16,25.4 102.16,22.03 arc-90 101.6,21.47 101.4,21.47 arc-90 100.84,22.03 100.84,25.4 arc90 100.58,25.65 100.42,25.65 98.7,27.37 98.7,29.62 v98.25,30.07
  Bottom_GND_SIG 0.127: J100_FMC:FMC1.K5 v98.25,30.07
EXP1_DIFF_CLK_IN_CLK2_P  (via drill 0.2 layers 1-7, 0.2 pad 0.46 layers 7-16)
  Top_SIG1 0.102: QSE_J401.42 v134.93,45.21
  7_SIG4 0.089: v134.93,45.21 134.72,45.21 134.47,44.96 123.38,44.96 112.93,34.51 112.93,30.24 109.62,26.93 arc-90 109.26,26.93 arc90 108.9,26.93 108.86,26.88 arc90 108.86,26.52 arc-90 108.86,26.17 108.65,25.96 108.51,25.96 arc90 107.95,25.4 107.95,22.03 arc-90 107.7,21.78 107.49,21.78 arc-90 107.24,22.03 107.24,25.4 arc90 106.68,25.96 106.48,25.96 arc90 105.92,25.4 105.92,22.03 arc-90 105.66,21.78 105.46,21.78 arc-90 105.21,22.03 105.21,25.4 arc90 104.65,25.96 104.45,25.96 arc90 103.89,25.4 103.89,22.06 arc-90 103.63,21.8 103.43,21.8 arc-90 103.18,22.06 103.18,25.4 arc90 102.62,25.96 102.41,25.96 arc90 101.86,25.4 101.86,22.03 arc-90 101.6,21.78 101.4,21.78 arc-90 101.14,22.03 101.14,25.4 arc90 100.58,25.96 100.55,25.96 99.01,27.5 99.01,29.62 v99.47,30.07
  Bottom_GND_SIG 0.127: J100_FMC:FMC1.K4 v99.47,30.07
EXP1_DIFF_CLK_OUT_CLK3_N  (via drill 0.2 layers 1-3, 0.2 pad 0.46 layers 3-16)
  Top_SIG1 0.102: QSE_J401.74 133.05,32.41 v134.93,32.41
  3_SIG2 0.089: v100.69,31.19 101.09,30.89 101.24,30.73 101.24,29.6 101.64,29.21 102.37,29.21 arc-90 102.63,28.96 102.63,24.08 arc90 103.19,23.52 103.32,23.52 arc90 103.88,24.08 103.88,28.96 arc-90 104.14,29.21 104.27,29.21 arc-90 104.53,28.96 104.53,24.08 arc90 105.08,23.52 105.22,23.52 arc90 105.78,24.08 105.78,28.96 arc-90 106.03,29.21 106.17,29.21 arc-90 106.42,28.96 106.42,24.08 arc90 106.98,23.52 107.12,23.52 arc90 107.68,24.08 107.68,28.96 arc-90 107.93,29.21 108.07,29.21 arc-90 108.32,28.96 108.32,24.08 arc90 108.88,23.52 109.02,23.52 arc90 109.58,24.08 109.58,28.96 arc-90 109.83,29.21 114.87,29.21 119.55,33.88 127.65,33.88 128.77,32.77 134.81,32.77 134.9,32.73 134.97,32.62 v134.93,32.41
  Bottom_GND_SIG 0.127: J100_FMC:FMC1.J3 v100.69,31.19
EXP1_DIFF_CLK_OUT_CLK3_P  (via drill 0.2 layers 1-3, 0.2 pad 0.46 layers 3-16)
  Top_SIG1 0.102: QSE_J401.72 v134.93,33.22
  3_SIG2 0.089: v102.01,31.19 101.6,30.89 101.55,30.84 101.55,29.73 101.77,29.52 102.37,29.52 arc-90 102.93,28.96 102.93,24.08 arc90 103.19,23.82 103.32,23.82 arc90 103.58,24.08 103.58,28.96 arc-90 104.14,29.52 104.27,29.52 arc-90 104.83,28.96 104.83,24.08 arc90 105.08,23.82 105.22,23.82 arc90 105.47,24.08 105.47,28.96 arc-90 106.03,29.52 106.17,29.52 arc-90 106.73,28.96 106.73,24.08 arc90 106.98,23.82 107.12,23.82 arc90 107.37,24.08 107.37,28.96 arc-90 107.93,29.52 108.07,29.52 arc-90 108.63,28.96 108.63,24.08 arc90 108.88,23.82 109.02,23.82 arc90 109.27,24.08 109.27,28.96 arc-90 109.83,29.52 114.75,29.52 119.42,34.19 127.77,34.19 128.89,33.07 132.69,33.07 arc90 132.94,33.33 132.94,33.39 arc-90 133.2,33.65 133.23,33.65 arc-90 133.48,33.39 133.48,33.33 arc90 133.74,33.07 134.87,33.07 v134.93,33.22
  Bottom_GND_SIG 0.127: J100_FMC:FMC1.J2 v102.01,31.19
EXP2_DIFF_CLK_IN_N  (via drill 0.2 layers 1-7, 0.2 pad 0.46 layers 7-16)
  Top_SIG1 0.102: QSE_J402.44 v25.09,44.4
  7_SIG4 0.089: v25.09,44.4 25.35,44.65 27.91,44.65 arc-90 28.18,44.39 28.18,42.2 arc90 28.74,41.63 28.81,41.63 arc90 29.38,42.2 29.38,44.39 arc-90 29.64,44.65 29.71,44.65 arc-90 29.97,44.39 29.97,42.2 arc90 30.53,41.63 30.61,41.63 arc90 31.17,42.2 31.17,44.39 arc-90 31.43,44.65 31.5,44.65 arc-90 31.76,44.39 31.76,42.2 arc90 32.33,41.63 32.4,41.63 arc90 32.96,42.2 32.96,44.39 arc-90 33.22,44.65 33.3,44.65 arc-90 33.56,44.39 33.56,42.2 arc90 34.12,41.63 34.19,41.63 arc90 34.76,42.2 34.76,44.39 arc-90 35.02,44.65 73.29,44.65 75.83,42.11 75.83,38.46 76.14,38.15 76.81,38.15 77.11,37.85 77.39,37.85 77.7,38.15 78.37,38.15 78.49,38.04 78.49,37.82 78.36,37.69 77.93,37.69 v77.83,37.59
  Bottom_GND_SIG 0.089: 77.83,37.55 v77.83,37.59
  Bottom_GND_SIG 0.102: 77.83,37.55 J100_FMC:FMC1.D21
EXP2_DIFF_CLK_IN_P  (via drill 0.2 layers 1-7, 0.2 pad 0.46 layers 7-16)
  Top_SIG1 0.102: QSE_J402.42 v25.09,45.21